# EAGLE design Spine14v1 (EAGLE 6.4)
AUTHOR_1: Jonathan Kurzer; AUTHOR_2: Jason Leung; AUTHOR_3: Matthew Sauve; AUTHOR_4: Ian Lin; AUTHOR_5: John Connolly; ORGANIZATION_INFO: Michigan Autonomous Aerial Vehicles; REV: 14v1

## Sheet 1 of 5
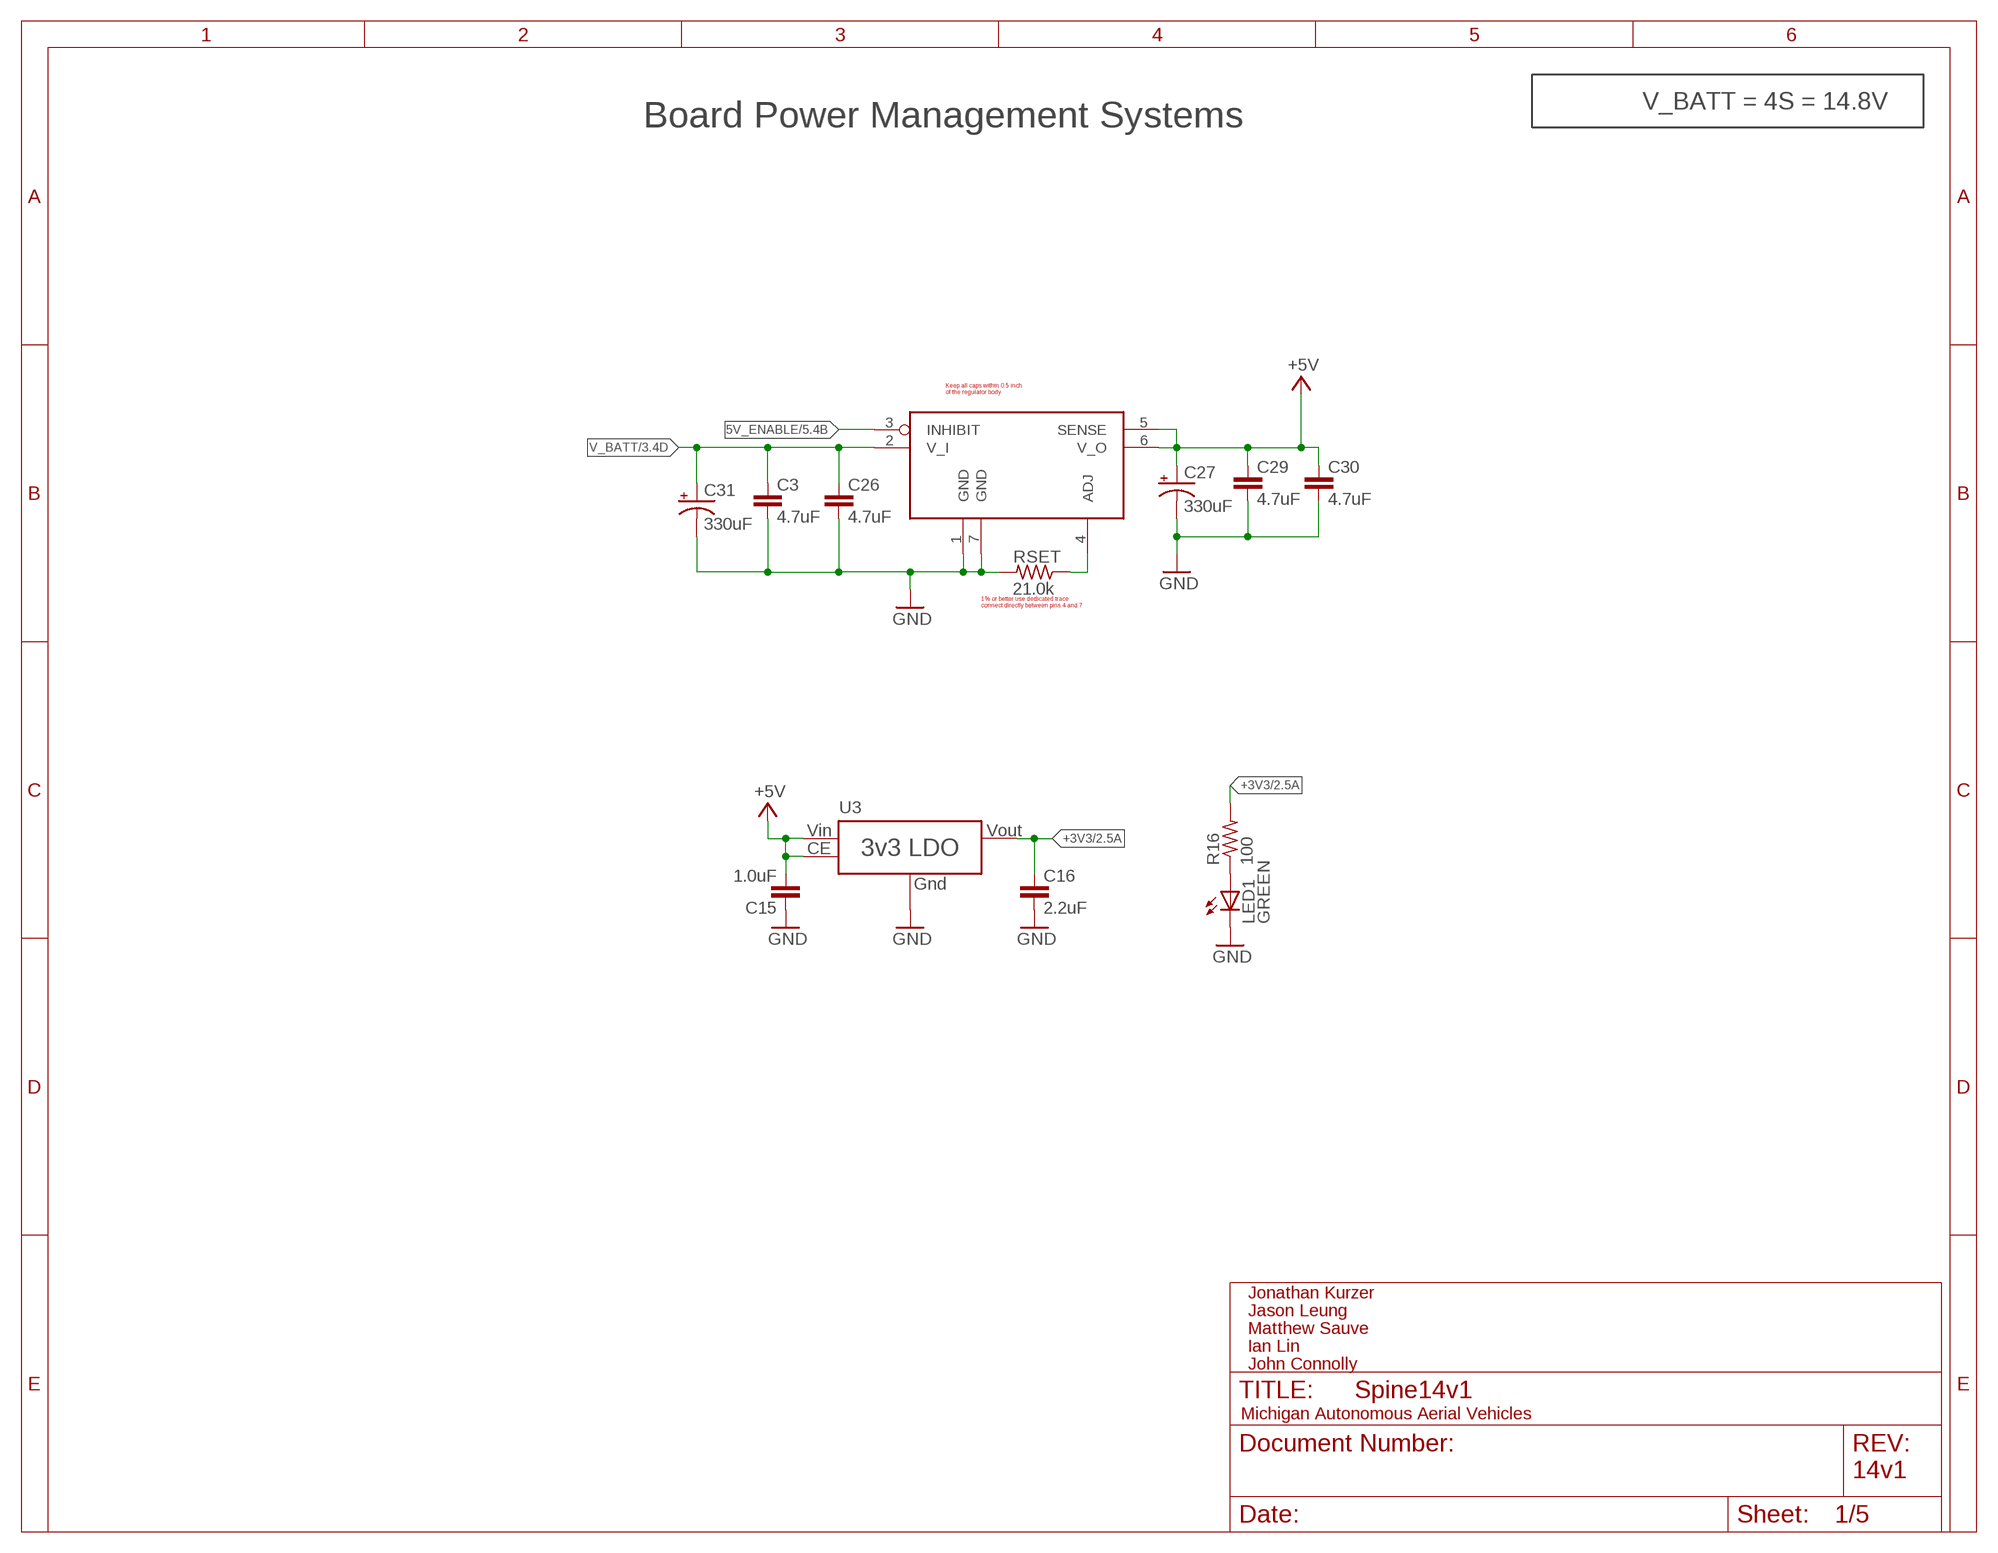
[diagram p0: schematic, sheet 1]

### Parts
C3  4.7uF  C-EUC1206  [C1206]
C15  1.0uF  C-EUC0805  [C0805]
C16  2.2uF  C-EUC0805  [C0805]
C26  4.7uF  C-EUC1206  [C1206]
C27  330uF  CPOL-USF  [PANASONIC_F]
C29  4.7uF  C-EUC1206  [C1206]
C30  4.7uF  C-EUC1206  [C1206]
C31  330uF  CPOL-USF  [PANASONIC_F]
LED1  GREEN  LEDCHIPLED_0603  [CHIPLED_0603]
R16  100  R-USR0603  [R0603]
RSET  21.0k  R-USR0603  [R0603]
U3  XC6210  [SOT-25]
U$5  POWER-MODULE-TI-6A_SOLDERLESS_TERMINAL  [POWER-MOD-TI-6A-SOLDERLESS-TERMINAL]

### Nets
5V_ENABLE: U$5.3(INHIBIT) ; also sheet 5
+3V3: C16.1 R16.2 U3.5(VOUT) ; also sheet 2,3,4,5
+5V: C15.2 C27.+ C29.1 C30.1 U3.1(VIN) U3.3(CE) U$5.5(SENSE) U$5.6(V_O) ; also sheet 2,3,5
GND: C3.2 C15.1 C16.2 C26.2 C27.- C29.2 C30.2 C31.- LED1.C RSET.2 U3.2(GND) U$5.1(GND) U$5.7(GND) ; also sheet 2,3,4,5
N$8: LED1.A R16.1
N$18: RSET.1 U$5.4(ADJ)
V_BATT: C3.1 C26.1 C31.+ U$5.2(V_I) ; also sheet 3,5

### Notes on the sheet
- V_BATT = 4S = 14.8V
- Board Power Management Systems
- Keep all caps within 0.5 inch
  of the regulator body
- 1% or better use dedicated trace
  connect directly between pins 4 and 7

## Sheet 2 of 5
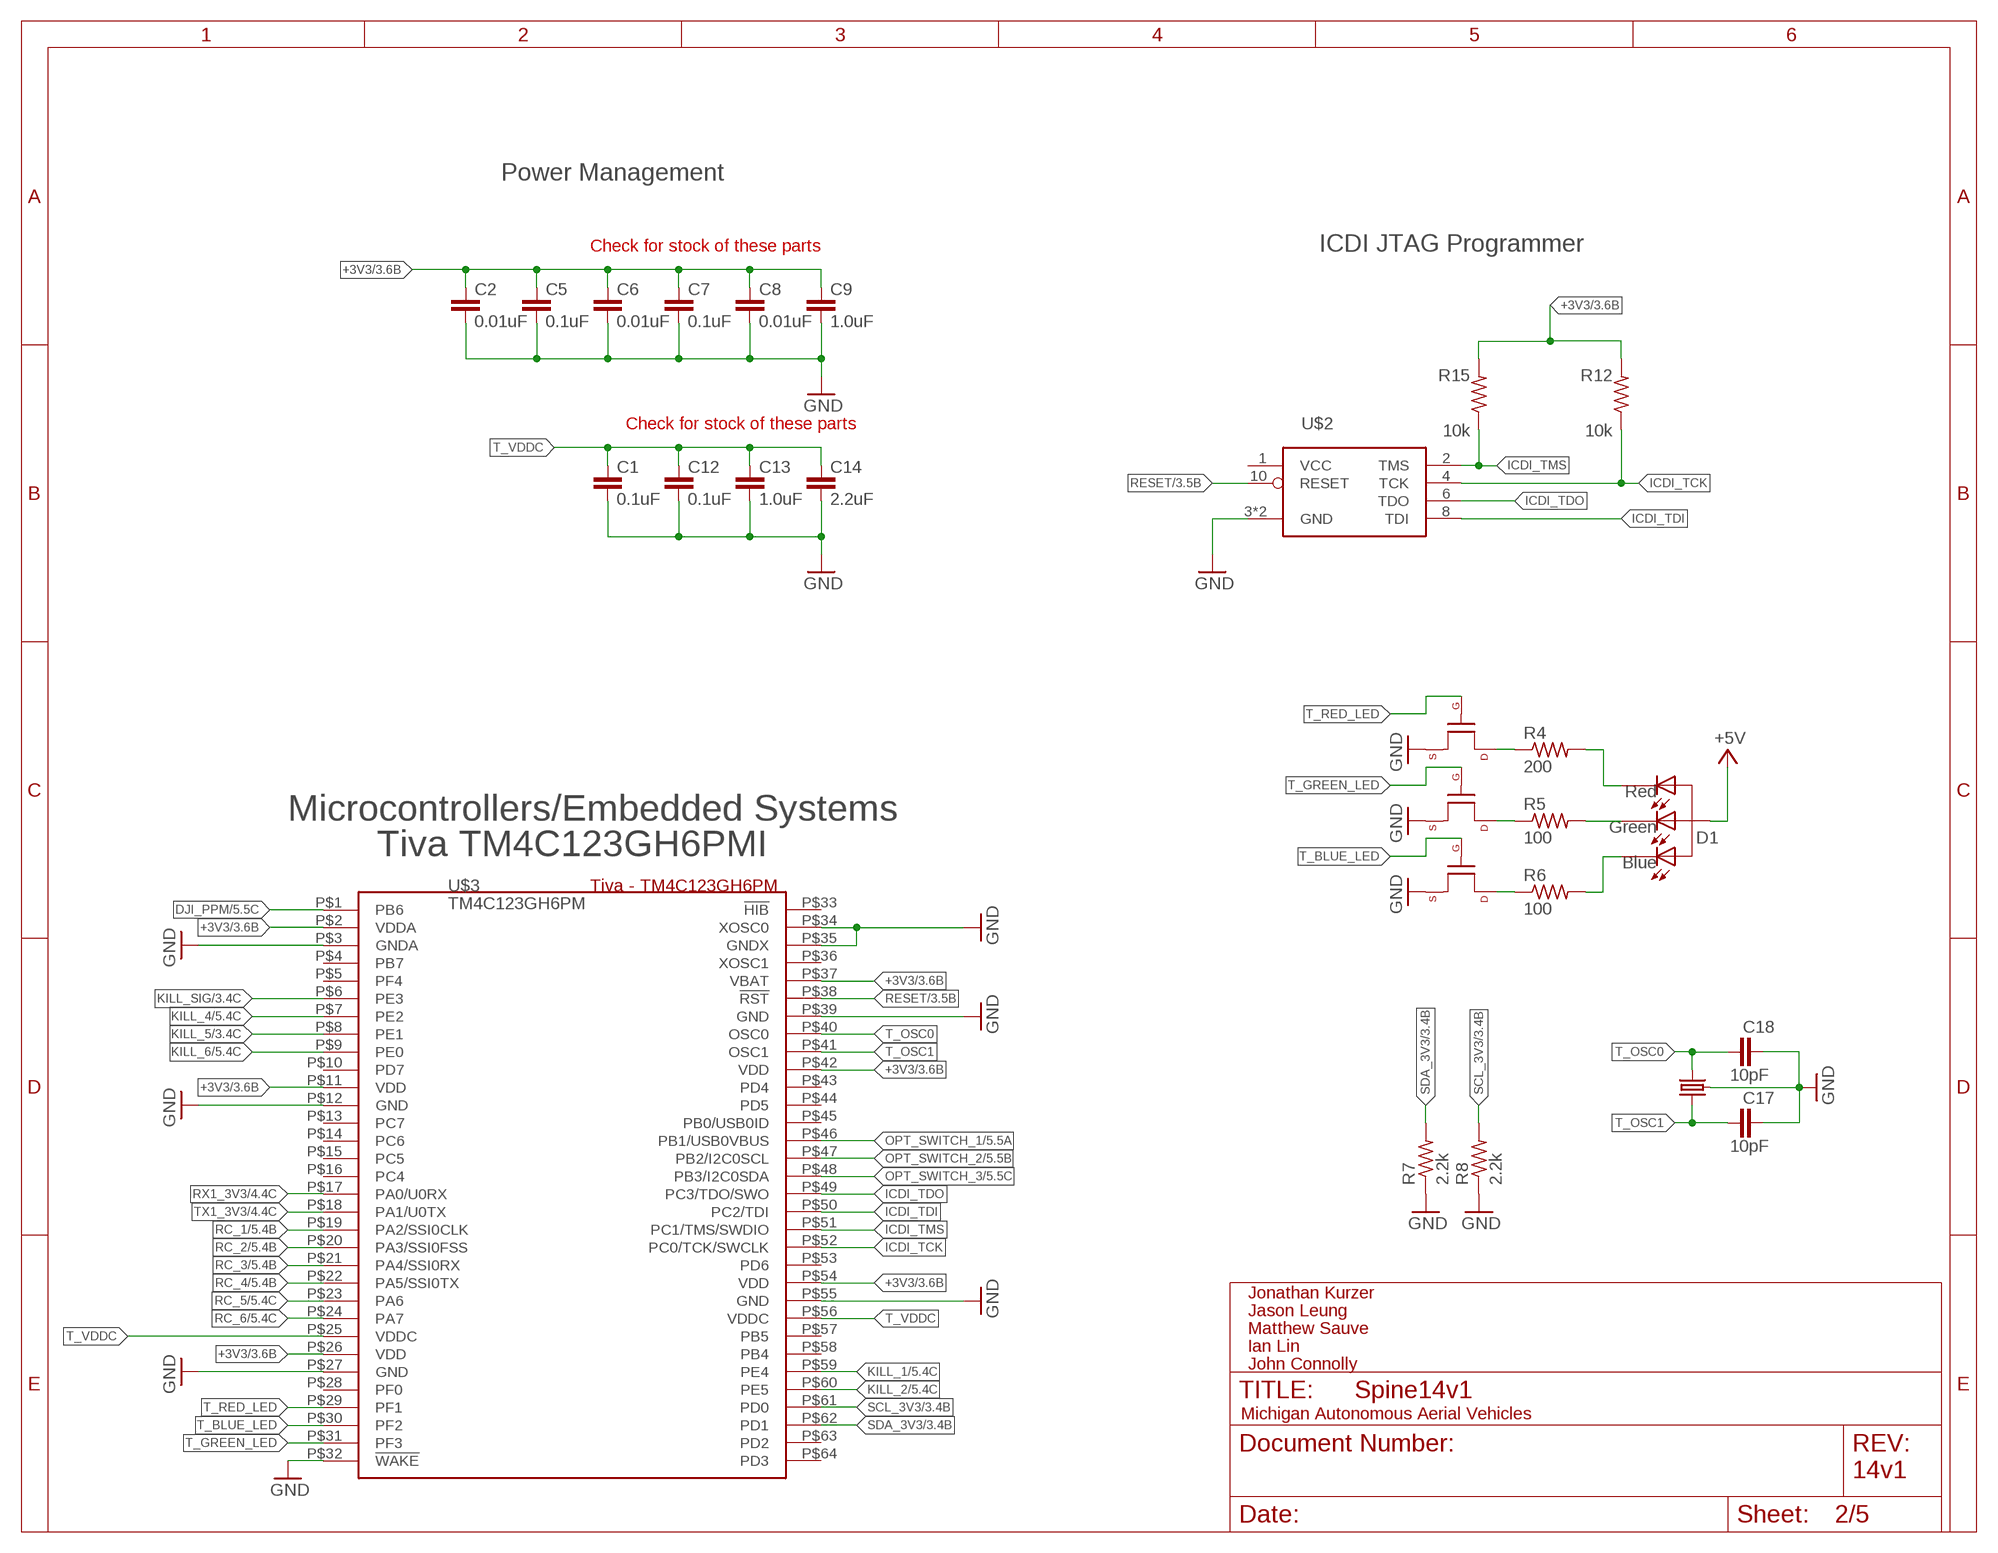
[diagram p1: schematic, sheet 2]

### Parts
C1  0.1uF  C-EUC0603  [C0603]
C2  0.01uF  C-EUC0603  [C0603]
C5  0.1uF  C-EUC0603  [C0603]
C6  0.01uF  C-EUC0603  [C0603]
C7  0.1uF  C-EUC0603  [C0603]
C8  0.01uF  C-EUC0603  [C0603]
C9  1.0uF  C-EUC0603  [C0603]
C12  0.1uF  C-EUC0603  [C0603]
C13  1.0uF  C-EUC0805  [C0805]
C14  2.2uF  C-EUC0805  [C0805]
C17  10pF  C-EUC0603  [C0603]
C18  10pF  C-EUC0603  [C0603]
D1  LED_RGB_CA  [LED_RGB_0606]
Q2  MOSFET-NCHANNELSMD  [SOT23-3]
Q3  MOSFET-NCHANNELSMD  [SOT23-3]
Q4  MOSFET-NCHANNELSMD  [SOT23-3]
R4  200  R-USR0603  [R0603]
R5  100  R-USR0603  [R0603]
R6  100  R-USR0603  [R0603]
R7  2.2k  R-USR0603  [R0603]
R8  2.2k  R-USR0603  [R0603]
R12  10k  R-USR0603  [R0603]
R15  10k  R-USR0603  [R0603]
U$1  CRYSTAL_403C11E16  [4-SMD-SWITCH]
U$2  JTAG-ARM_TC-10  [TC2050-IDC]
U$3  TM4C123GH6PM  [TM4C123GH6PM]

### Nets
+3V3: C2.1 C5.1 C6.1 C7.1 C8.1 C9.1 R12.2 R15.2 U$3.P$2(VDDA) U$3.P$11(VDD) U$3.P$26(VDD) U$3.P$37(VBAT) U$3.P$42(VDD) U$3.P$54(VDD) ; also sheet 1,3,4,5
+5V: D1.1(A) ; also sheet 1,3,5
DJI_PPM: U$3.P$1(PB6) ; also sheet 5
GND: C1.2 C2.2 C5.2 C6.2 C7.2 C8.2 C9.2 C12.2 C13.2 C14.2 C17.2 C18.2 Q2.2(S) Q3.2(S) Q4.2(S) R7.1 R8.1 U$1.2(GND) U$1.4(GND) U$2.3(GND) U$2.9(GND) U$3.P$3(GNDA) U$3.P$12(GND) U$3.P$27(GND) U$3.P$32(!WAKE) U$3.P$34(XOSC0) U$3.P$35(GNDX) U$3.P$39(GND) U$3.P$55(GND) ; also sheet 1,3,4,5
ICDI_TCK: R12.1 U$2.4(TCK) U$3.P$52(PC0/TCK/SWCLK)
ICDI_TDI: U$2.8(TDI) U$3.P$50(PC2/TDI)
ICDI_TDO: U$2.6(TDO) U$3.P$49(PC3/TDO/SWO)
ICDI_TMS: R15.1 U$2.2(TMS) U$3.P$51(PC1/TMS/SWDIO)
KILL_1: U$3.P$59(PE4) ; also sheet 5
KILL_2: U$3.P$60(PE5) ; also sheet 5
KILL_4: U$3.P$7(PE2) ; also sheet 5
KILL_5: U$3.P$8(PE1) ; also sheet 3,5
KILL_6: U$3.P$9(PE0) ; also sheet 5
KILL_SIG: U$3.P$6(PE3) ; also sheet 3,5
N$3: Q4.3(D) R4.1
N$4: Q3.3(D) R5.1
N$5: Q2.3(D) R6.1
N$6: D1.2(R) R4.2
N$7: D1.3(G) R5.2
N$19: D1.4(B) R6.2
OPT_SWITCH_1: U$3.P$46(PB1/USB0VBUS) ; also sheet 5
OPT_SWITCH_2: U$3.P$47(PB2/I2C0SCL) ; also sheet 5
OPT_SWITCH_3: U$3.P$48(PB3/I2C0SDA) ; also sheet 5
RC_1: U$3.P$19(PA2/SSI0CLK) ; also sheet 5
RC_2: U$3.P$20(PA3/SSI0FSS) ; also sheet 5
RC_3: U$3.P$21(PA4/SSI0RX) ; also sheet 5
RC_4: U$3.P$22(PA5/SSI0TX) ; also sheet 5
RC_5: U$3.P$23(PA6) ; also sheet 5
RC_6: U$3.P$24(PA7) ; also sheet 5
RESET: U$2.10(RESET) U$3.P$38(!RST) ; also sheet 3,5
RX1_3V3: U$3.P$17(PA0/U0RX) ; also sheet 4
SCL_3V3: R8.2 U$3.P$61(PD0) ; also sheet 3,5
SDA_3V3: R7.2 U$3.P$62(PD1) ; also sheet 3,5
T_BLUE_LED: Q2.1(G) U$3.P$30(PF2)
T_GREEN_LED: Q3.1(G) U$3.P$31(PF3)
T_OSC0: C18.1 U$1.3 U$3.P$40(OSC0)
T_OSC1: C17.1 U$1.1 U$3.P$41(OSC1)
T_RED_LED: Q4.1(G) U$3.P$29(PF1)
T_VDDC: C1.1 C12.1 C13.1 C14.1 U$3.P$25(VDDC) U$3.P$56(VDDC)
TX1_3V3: U$3.P$18(PA1/U0TX) ; also sheet 4
Unconnected: U$2.1(VCC) U$3.P$4(PB7) U$3.P$5(PF4) U$3.P$10(PD7) U$3.P$13(PC7) U$3.P$14(PC6) U$3.P$15(PC5) U$3.P$16(PC4) U$3.P$28(PF0) U$3.P$33(!HIB) U$3.P$36(XOSC1) U$3.P$43(PD4) U$3.P$44(PD5) U$3.P$45(PB0/USB0ID) U$3.P$53(PD6) U$3.P$57(PB5) U$3.P$58(PB4) U$3.P$63(PD2) U$3.P$64(PD3)

### Notes on the sheet
- Power Management
- Check for stock of these parts | ICDI JTAG Programmer
- Check for stock of these parts
- Microcontrollers/Embedded Systems
- Tiva TM4C123GH6PMI

## Sheet 3 of 5
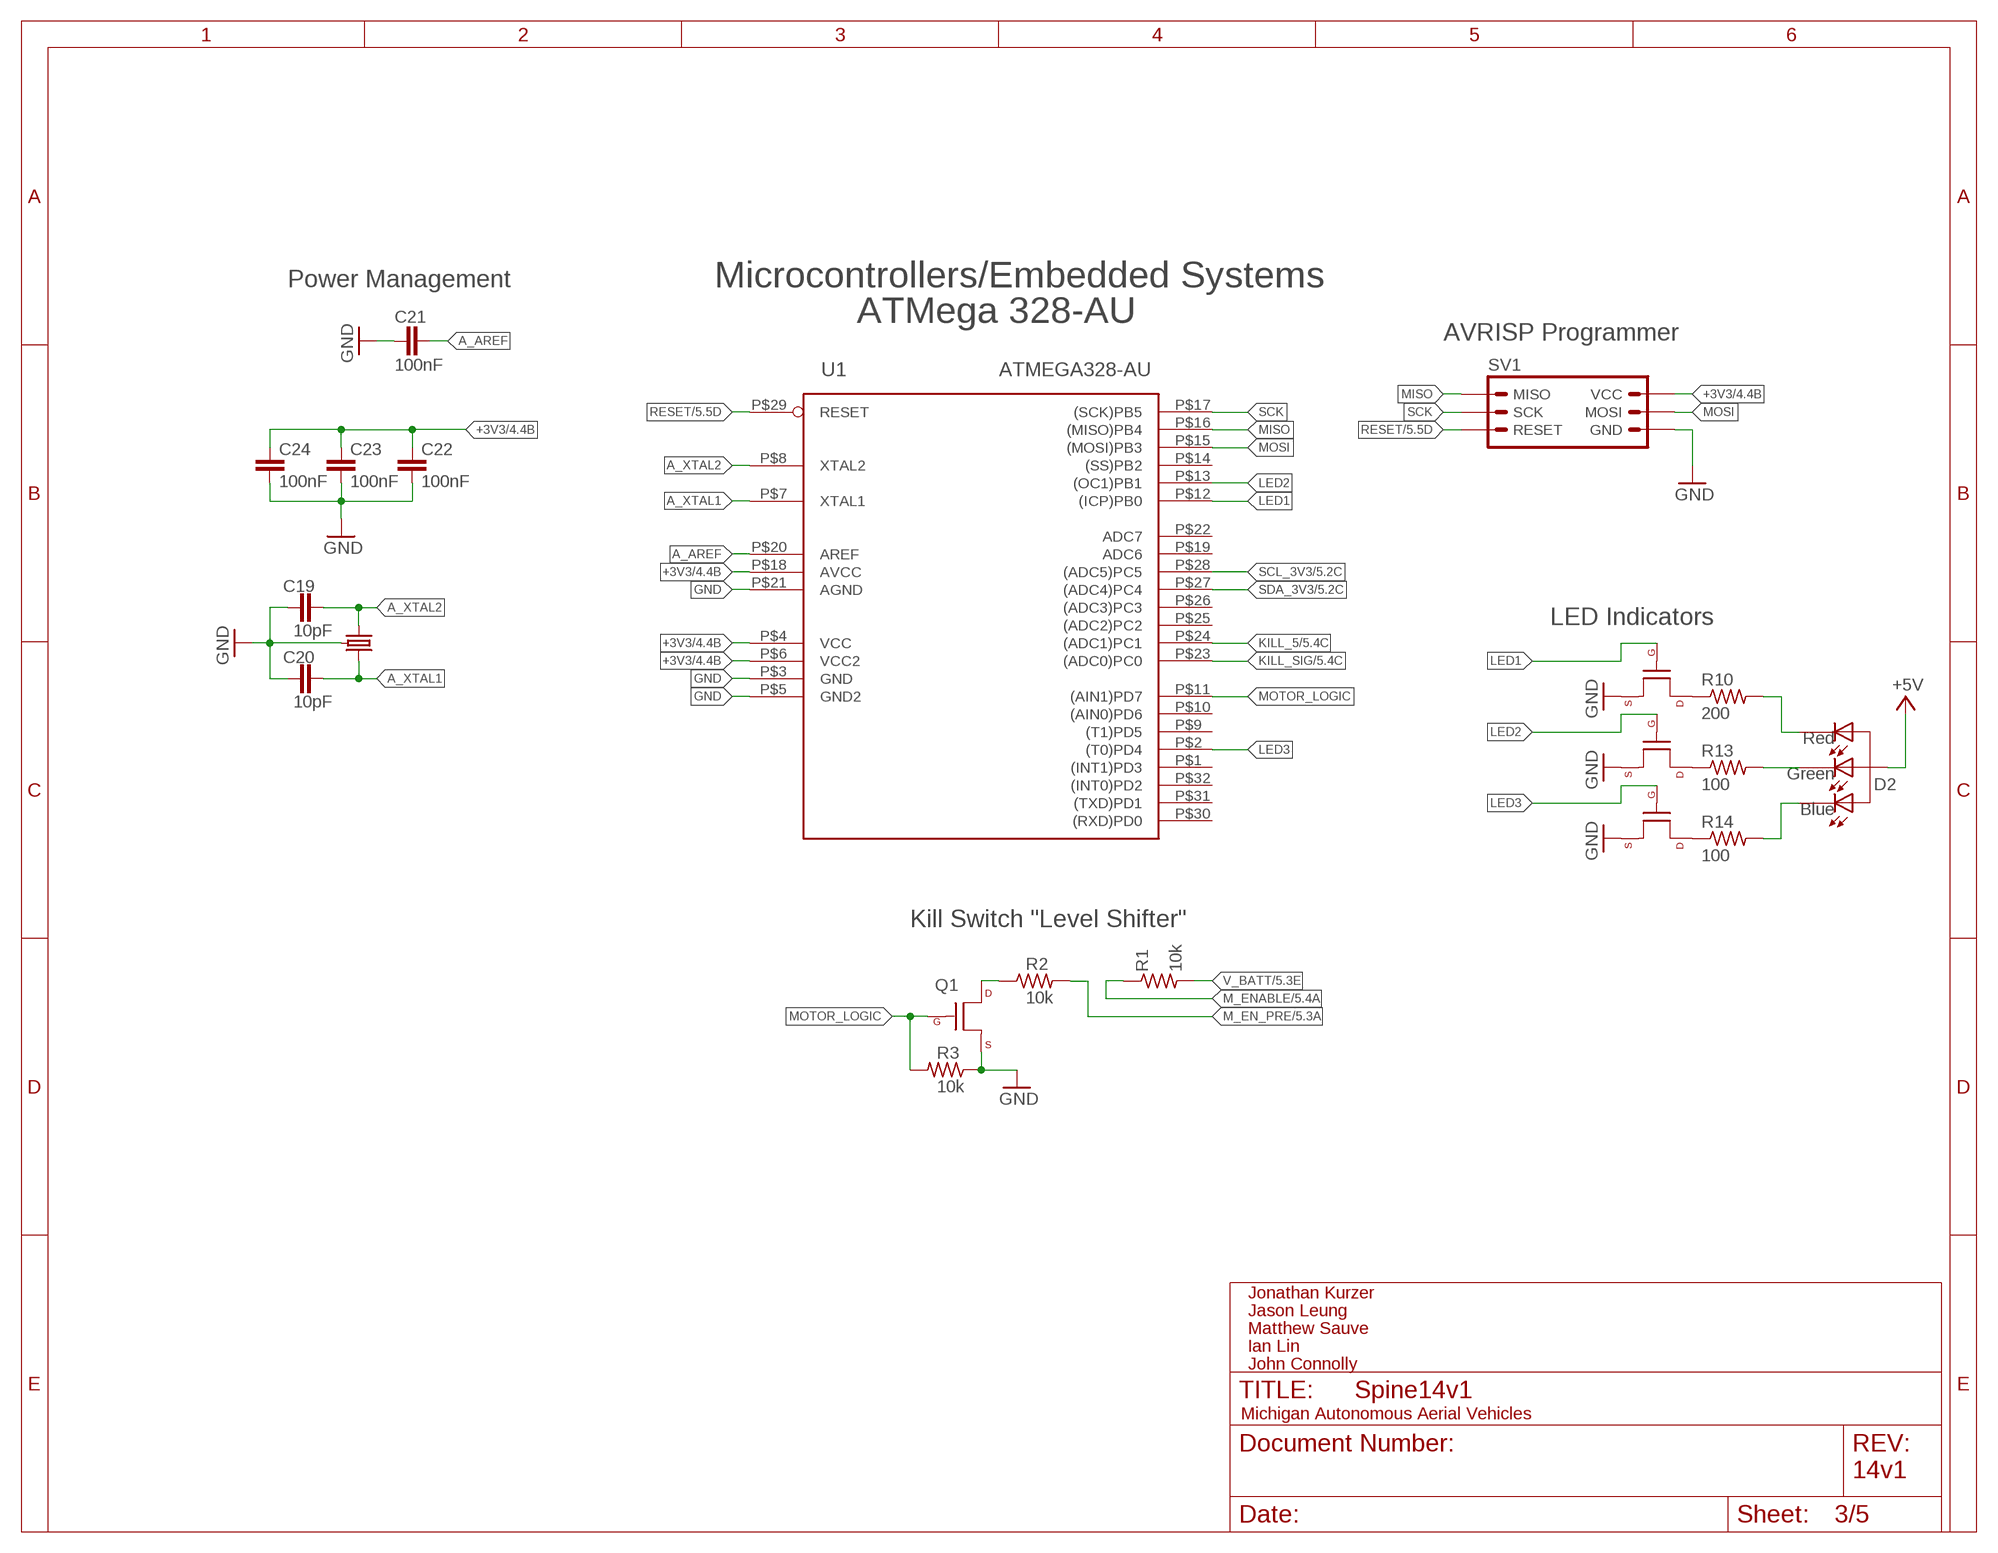
[diagram p2: schematic, sheet 3]

### Parts
C19  10pF  C-EUC0603  [C0603]
C20  10pF  C-EUC0603  [C0603]
C21  100nF  C-EUC0603  [C0603]
C22  100nF  C-EUC0603  [C0603]
C23  100nF  C-EUC0603  [C0603]
C24  100nF  C-EUC0603  [C0603]
D2  LED_RGB_CA  [LED_RGB_0606]
Q1  MOSFET-NCHANNELSMD  [SOT23-3]
Q6  MOSFET-NCHANNELSMD  [SOT23-3]
Q7  MOSFET-NCHANNELSMD  [SOT23-3]
Q8  MOSFET-NCHANNELSMD  [SOT23-3]
R1  10k  R-USR0603  [R0603]
R2  10k  R-USR0603  [R0603]
R3  10k  R-USR0603  [R0603]
R10  200  R-USR0603  [R0603]
R13  100  R-USR0603  [R0603]
R14  100  R-USR0603  [R0603]
SV1  AVRISP-6_3X2_PLUG_OF_NAILS  [TC2030-IDC]
U1  ATMEGA328-AU  [32-TQFP]
U$6  CRYSTAL_403C11E16  [4-SMD-SWITCH]

### Nets
+3V3: C22.1 C23.1 C24.1 SV1.6(VCC) U1.P$4(VCC) U1.P$6(VCC2) U1.P$18(AVCC) ; also sheet 1,2,4,5
+5V: D2.1(A) ; also sheet 1,2,5
A_AREF: C21.1 U1.P$20(AREF)
A_XTAL1: C20.2 U1.P$7(XTAL1) U$6.3
A_XTAL2: C19.2 U1.P$8(XTAL2) U$6.1
GND: C19.1 C20.1 C21.2 C22.2 C23.2 C24.2 Q1.2(S) Q6.2(S) Q7.2(S) Q8.2(S) R3.1 SV1.4(GND) U1.P$3(GND) U1.P$5(GND2) U1.P$21(AGND) U$6.2(GND) U$6.4(GND) ; also sheet 1,2,4,5
KILL_5: U1.P$24((ADC1)PC1) ; also sheet 2,5
KILL_SIG: U1.P$23((ADC0)PC0) ; also sheet 2,5
LED1: Q8.1(G) U1.P$12((ICP)PB0)
LED2: Q7.1(G) U1.P$13((OC1)PB1)
LED3: Q6.1(G) U1.P$2((T0)PD4)
M_EN_PRE: R2.2 ; also sheet 5
M_ENABLE: R1.1 ; also sheet 5
MISO: SV1.1(MISO) U1.P$16((MISO)PB4)
MOSI: SV1.5(MOSI) U1.P$15((MOSI)PB3)
MOTOR_LOGIC: Q1.1(G) R3.2 U1.P$11((AIN1)PD7)
N$1: Q1.3(D) R2.1
N$12: Q8.3(D) R10.1
N$20: Q7.3(D) R13.1
N$22: Q6.3(D) R14.1
N$23: D2.2(R) R10.2
N$24: D2.3(G) R13.2
N$25: D2.4(B) R14.2
RESET: SV1.3(RESET) U1.P$29(RESET) ; also sheet 2,5
SCK: SV1.2(SCK) U1.P$17((SCK)PB5)
SCL_3V3: U1.P$28((ADC5)PC5) ; also sheet 2,5
SDA_3V3: U1.P$27((ADC4)PC4) ; also sheet 2,5
V_BATT: R1.2 ; also sheet 1,5
Unconnected: U1.P$1((INT1)PD3) U1.P$9((T1)PD5) U1.P$10((AIN0)PD6) U1.P$14((SS)PB2) U1.P$19(ADC6) U1.P$22(ADC7) U1.P$25((ADC2)PC2) U1.P$26((ADC3)PC3) U1.P$30((RXD)PD0) U1.P$31((TXD)PD1) U1.P$32((INT0)PD2)

### Notes on the sheet
- Power Management | Microcontrollers/Embedded Systems
- ATMega 328-AU
- AVRISP Programmer
- LED Indicators
- Kill Switch "Level Shifter"

## Sheet 4 of 5
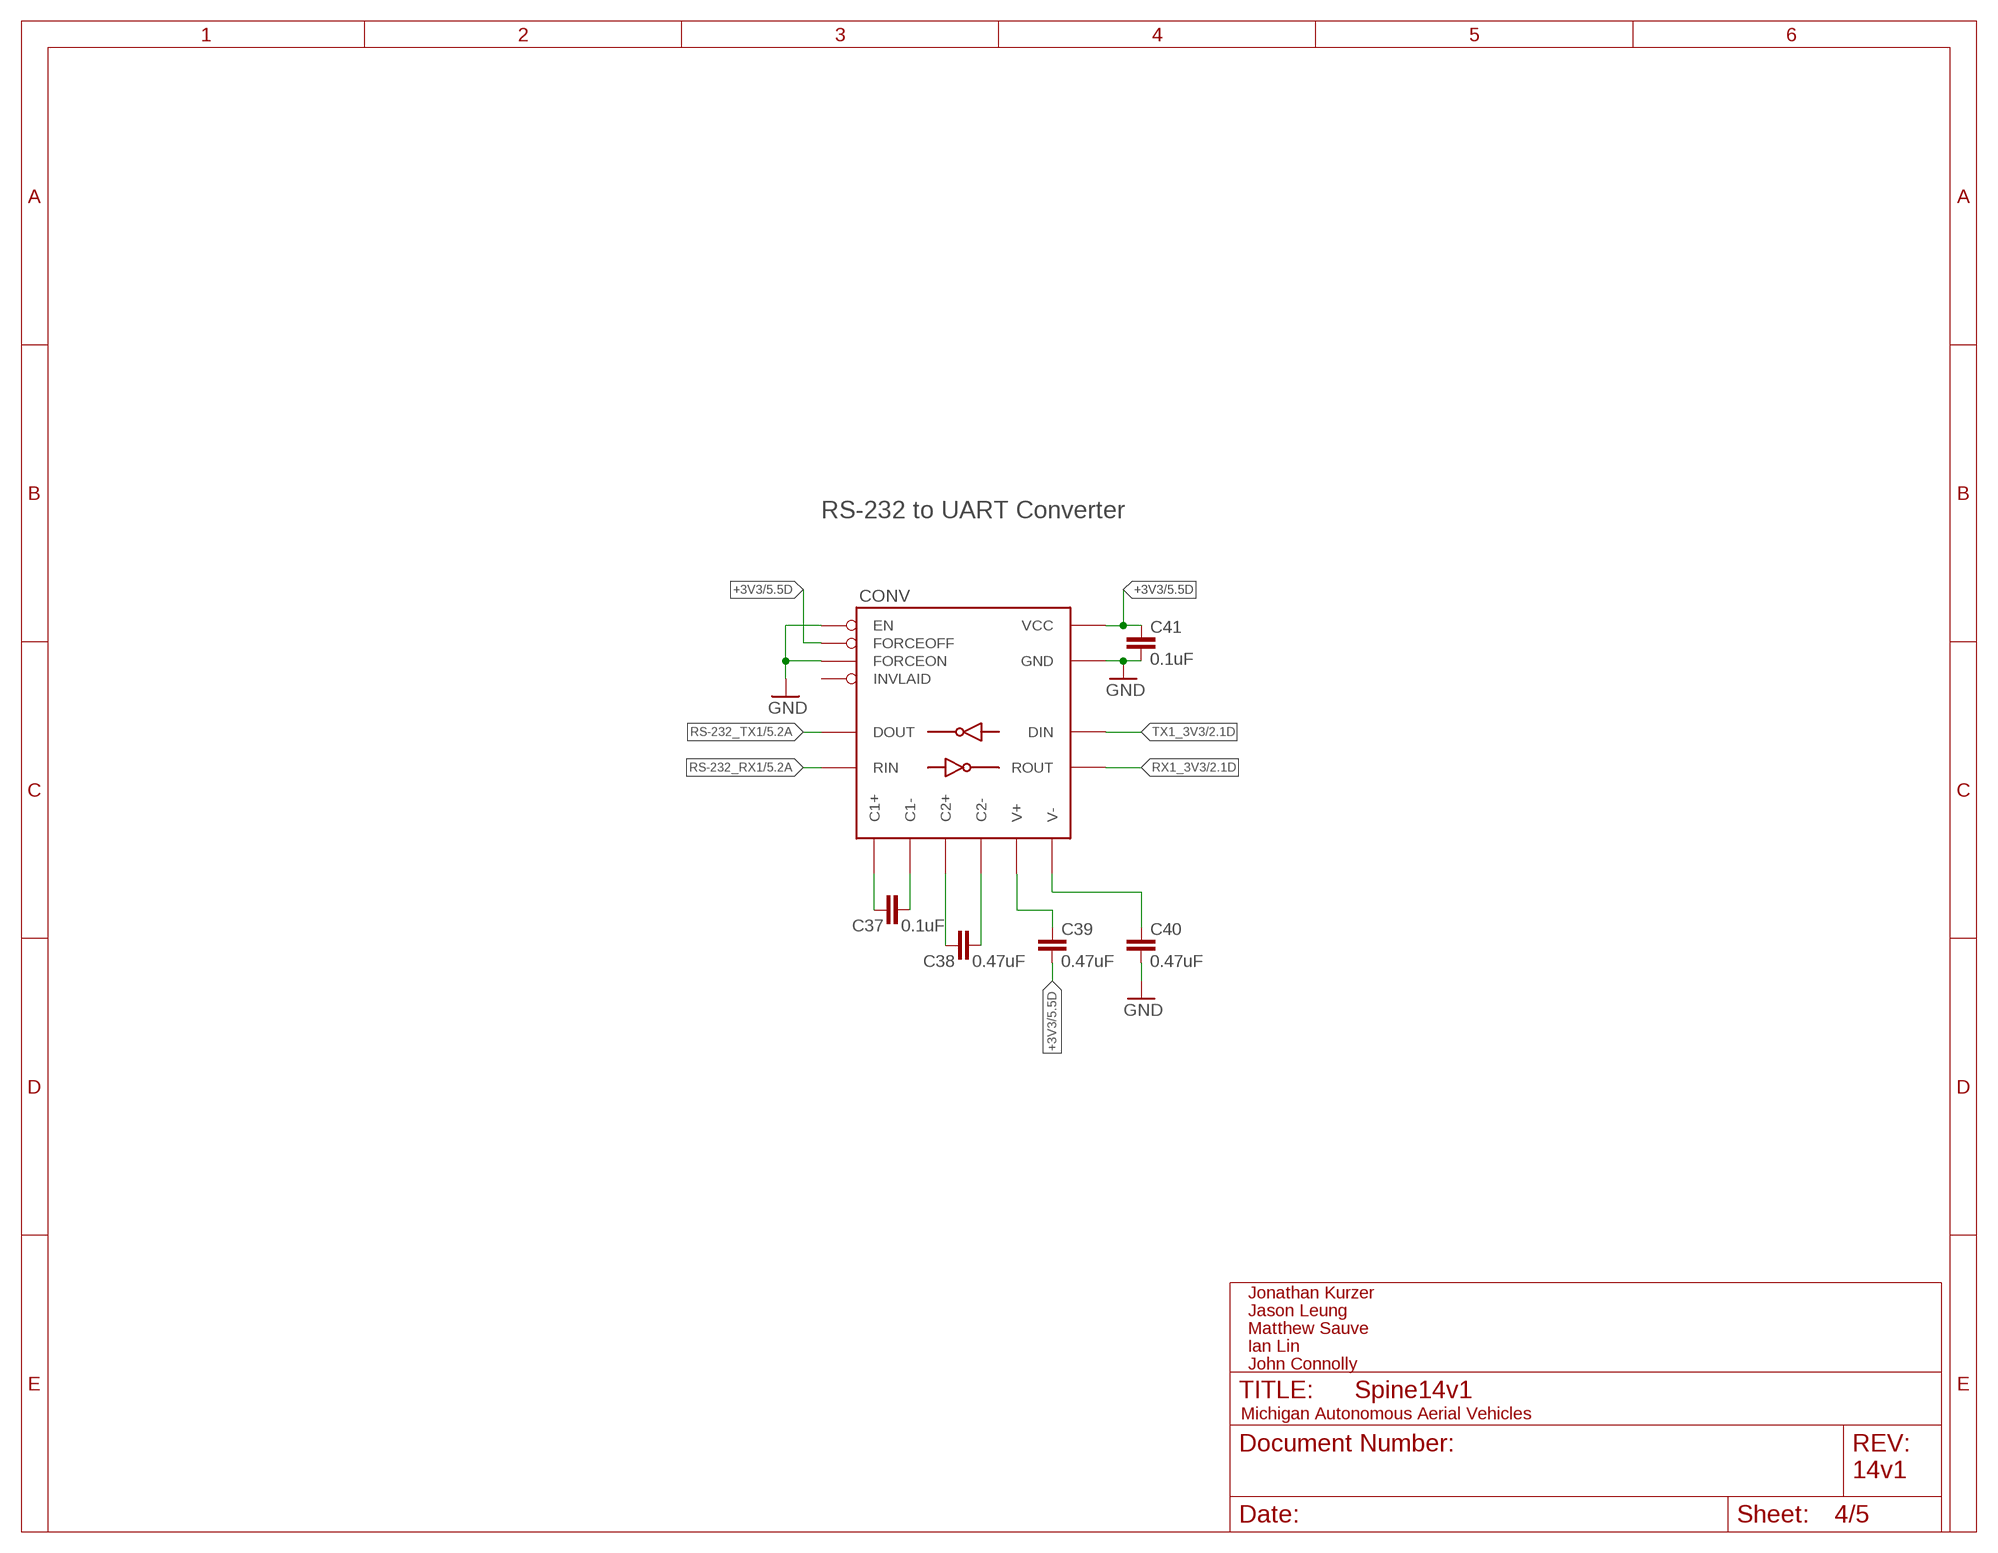
[diagram p3: schematic, sheet 4]

### Parts
C37  0.1uF  C-EUC0603  [C0603]
C38  0.47uF  C-EUC0805  [C0805]
C39  0.47uF  C-EUC0805  [C0805]
C40  0.47uF  C-EUC0805  [C0805]
C41  0.1uF  C-EUC0603  [C0603]
CONV  MAX3221-RS232  [16-TSSOP]

### Nets
+3V3: C39.2 C41.1 CONV.P$15(VCC) CONV.P$16(FORCEOFF) ; also sheet 1,2,3,5
GND: C40.2 C41.2 CONV.P$1(EN) CONV.P$12(FORCEON) CONV.P$14(GND) ; also sheet 1,2,3,5
N$11: C37.1 CONV.P$2(C1+)
N$13: C39.1 CONV.P$3(V+)
N$14: C40.1 CONV.P$7(V-)
N$32: C37.2 CONV.P$4(C1-)
N$35: C38.1 CONV.P$5(C2+)
N$36: C38.2 CONV.P$6(C2-)
RS-232_RX1: CONV.P$8(RIN) ; also sheet 5
RS-232_TX1: CONV.P$13(DOUT) ; also sheet 5
RX1_3V3: CONV.P$9(ROUT) ; also sheet 2
TX1_3V3: CONV.P$11(DIN) ; also sheet 2
Unconnected: CONV.P$10(INVLAID)

### Notes on the sheet
- RS-232 to UART Converter

## Sheet 5 of 5
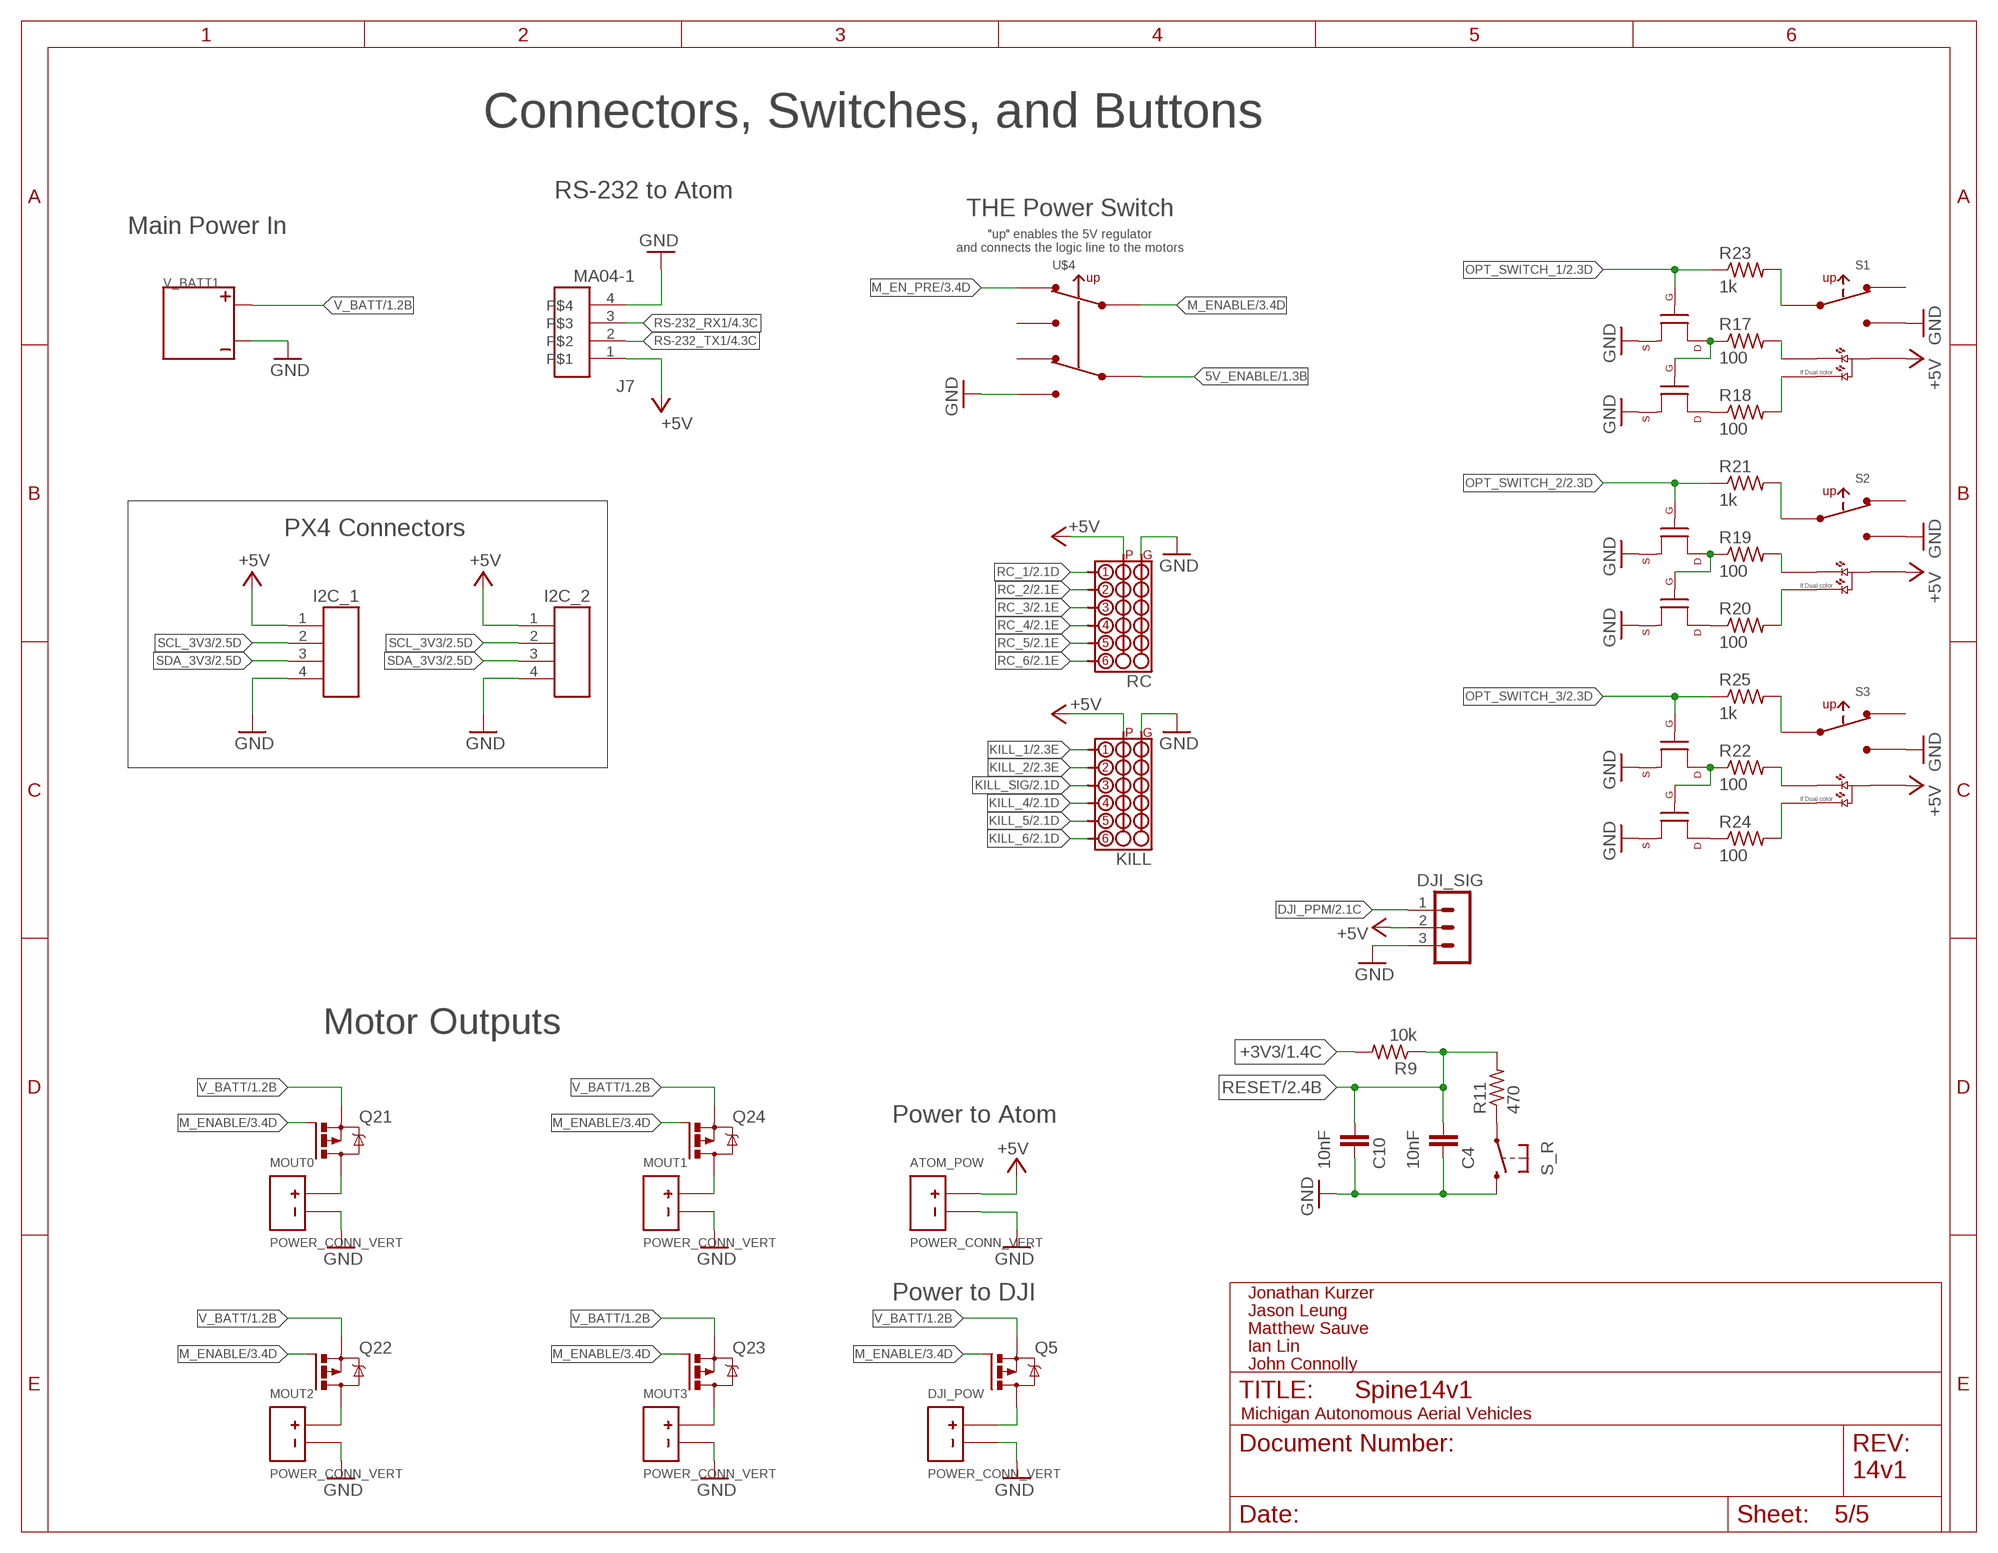
[diagram p4: schematic, sheet 5]

### Parts
ATOM_POW  POWER_CONN_VERT  [POWER_CONN]
C4  10nF  C-EUC0603  [C0603]
C10  10nF  C-EUC0603  [C0603]
DJI_POW  POWER_CONN_VERT  [POWER_CONN]
DJI_SIG  MA03-1  [MA03-1]
I2C_1  CONN_HEADER_4POS_RIGHT_ANGLE_I2C  [CONN_HEADER_4POS_1.25MM_SMD]
I2C_2  CONN_HEADER_4POS_RIGHT_ANGLE_I2C  [CONN_HEADER_4POS_1.25MM_SMD]
J7  MA04-1  [MA-04-SMD]
KILL  RC_RECIEVER_RECEP  [RC_RECIEVER_RECEP]
MOUT0  POWER_CONN_VERT  [POWER_CONN]
MOUT1  POWER_CONN_VERT  [POWER_CONN]
MOUT2  POWER_CONN_VERT  [POWER_CONN]
MOUT3  POWER_CONN_VERT  [POWER_CONN]
Q5  P-MOSFET-SO8POWER-PAK  [SO-8_POWER-PAK]
Q9  MOSFET-NCHANNELSMD  [SOT23-3]
Q10  MOSFET-NCHANNELSMD  [SOT23-3]
Q11  MOSFET-NCHANNELSMD  [SOT23-3]
Q12  MOSFET-NCHANNELSMD  [SOT23-3]
Q13  MOSFET-NCHANNELSMD  [SOT23-3]
Q14  MOSFET-NCHANNELSMD  [SOT23-3]
Q21  P-MOSFET-SO8POWER-PAK  [SO-8_POWER-PAK]
Q22  P-MOSFET-SO8POWER-PAK  [SO-8_POWER-PAK]
Q23  P-MOSFET-SO8POWER-PAK  [SO-8_POWER-PAK]
Q24  P-MOSFET-SO8POWER-PAK  [SO-8_POWER-PAK]
R9  10k  R-USR0603  [R0603]
R11  470  R-USR0603  [R0603]
R17  100  R-USR0603  [R0603]
R18  100  R-USR0603  [R0603]
R19  100  R-USR0603  [R0603]
R20  100  R-USR0603  [R0603]
R21  1k  R-USR0603  [R0603]
R22  100  R-USR0603  [R0603]
R23  1k  R-USR0603  [R0603]
R24  100  R-USR0603  [R0603]
R25  1k  R-USR0603  [R0603]
RC  RC_RECIEVER_RECEP  [RC_RECIEVER_RECEP]
S1  SWITCH_SPDT_ILUMINATED_2COLOR_VERT_ILLUMINATED  [NKK_VERT_SWITCH_6PIN]
S2  SWITCH_SPDT_ILUMINATED_2COLOR_VERT_ILLUMINATED  [NKK_VERT_SWITCH_6PIN]
S3  SWITCH_SPDT_ILUMINATED_2COLOR_VERT_ILLUMINATED  [NKK_VERT_SWITCH_6PIN]
S_R  TACT_BUTTONSMD  [TACT-MOM-SMD]
U$4  JON_LIB_SWITCH_DPDT  [JON_LIB_SWITCH_VERT_DPDT]
V_BATT1  BATT-CONN-50A_MINI-FIT-SR_THRU-HOLE  [BATT-CONN-50A]

### Nets
5V_ENABLE: U$4.P$5 ; also sheet 1
+3V3: R9.2 ; also sheet 1,2,3,4
+5V: ATOM_POW.P1(P) DJI_SIG.2 I2C_1.1 I2C_2.1 J7.1 KILL.VCC KILL.VCC2(VCC) RC.VCC RC.VCC2(VCC) S1.P$5 S2.P$5 S3.P$5 ; also sheet 1,2,3
DJI_PPM: DJI_SIG.1 ; also sheet 2
GND: ATOM_POW.P2(N) C4.2 C10.2 DJI_POW.P2(N) DJI_SIG.3 I2C_1.4 I2C_2.4 J7.4 KILL.GND KILL.GND2(GND) MOUT0.P2(N) MOUT1.P2(N) MOUT2.P2(N) MOUT3.P2(N) Q9.2(S) Q10.2(S) Q11.2(S) Q12.2(S) Q13.2(S) Q14.2(S) RC.GND RC.GND2(GND) S1.P$1 S2.P$1 S3.P$1 S_R.S S_R.S1(S) U$4.P$6 V_BATT1.GND-1(GND) V_BATT1.GND-2(GND) ; also sheet 1,2,3,4
KILL_1: KILL.P$1 ; also sheet 2
KILL_2: KILL.P$2 ; also sheet 2
KILL_4: KILL.P$4 ; also sheet 2
KILL_5: KILL.P$5 ; also sheet 2,3
KILL_6: KILL.P$6 ; also sheet 2
KILL_SIG: KILL.P$3 ; also sheet 2,3
M_EN_PRE: U$4.P$1 ; also sheet 3
M_ENABLE: Q5.G Q21.G Q22.G Q23.G Q24.G U$4.P$2 ; also sheet 3
N$2: MOUT0.P1(P) Q21.D1 Q21.D2(D1) Q21.D3(D1) Q21.D4(D1) Q21.D5(D1)
N$9: Q9.1(G) Q10.3(D) R17.1
N$10: R11.1 S_R.P S_R.P1(P)
N$15: MOUT1.P1(P) Q24.D1 Q24.D2(D1) Q24.D3(D1) Q24.D4(D1) Q24.D5(D1)
N$16: MOUT2.P1(P) Q22.D1 Q22.D2(D1) Q22.D3(D1) Q22.D4(D1) Q22.D5(D1)
N$17: MOUT3.P1(P) Q23.D1 Q23.D2(D1) Q23.D3(D1) Q23.D4(D1) Q23.D5(D1)
N$21: DJI_POW.P1(P) Q5.D1 Q5.D2(D1) Q5.D3(D1) Q5.D4(D1) Q5.D5(D1)
N$26: Q9.3(D) R18.1
N$27: Q11.1(G) Q12.3(D) R19.1
N$28: Q11.3(D) R20.1
N$29: R19.2 S2.P$6
N$30: R20.2 S2.P$4
N$31: R23.2 S1.P$2
N$33: R21.2 S2.P$2
N$34: R17.2 S1.P$6
N$37: R18.2 S1.P$4
N$39: Q13.1(G) Q14.3(D) R22.1
N$40: Q13.3(D) R24.1
N$41: R22.2 S3.P$6
N$42: R24.2 S3.P$4
N$43: R25.2 S3.P$2
OPT_SWITCH_1: Q10.1(G) R23.1 ; also sheet 2
OPT_SWITCH_2: Q12.1(G) R21.1 ; also sheet 2
OPT_SWITCH_3: Q14.1(G) R25.1 ; also sheet 2
RC_1: RC.P$1 ; also sheet 2
RC_2: RC.P$2 ; also sheet 2
RC_3: RC.P$3 ; also sheet 2
RC_4: RC.P$4 ; also sheet 2
RC_5: RC.P$5 ; also sheet 2
RC_6: RC.P$6 ; also sheet 2
RESET: C4.1 C10.1 R9.1 R11.2 ; also sheet 2,3
RS-232_RX1: J7.3 ; also sheet 4
RS-232_TX1: J7.2 ; also sheet 4
SCL_3V3: I2C_1.2 I2C_2.2 ; also sheet 2,3
SDA_3V3: I2C_1.3 I2C_2.3 ; also sheet 2,3
V_BATT: Q5.S1 Q5.S2(S1) Q5.S3(S1) Q21.S1 Q21.S2(S1) Q21.S3(S1) Q22.S1 Q22.S2(S1) Q22.S3(S1) Q23.S1 Q23.S2(S1) Q23.S3(S1) Q24.S1 Q24.S2(S1) Q24.S3(S1) V_BATT1.VCC-1(VCC) V_BATT1.VCC-2(VCC) ; also sheet 1,3
Unconnected: S1.P$3 S2.P$3 S3.P$3 U$4.P$3 U$4.P$4

### Notes on the sheet
- Connectors, Switches, and Buttons
- RS-232 to Atom
- THE Power Switch
- Main Power In
- "up" enables the 5V regulator
  and connects the logic line to the motors
- PX4 Connectors
- Motor Outputs
- Power to Atom
- Power to DJI

## Library data of the parts
ATOM_POW DJI_POW MOUT0 MOUT1-MOUT3 = MAAV:POWER_CONN; DIGIKEY: A30614-ND
C1 C2 C4-C10 C12-C16 = Jon_LIB:C-EU: CAPACITOR, European symbol
C3 C26 C29 C30 = Jon_LIB:C-EU: CAPACITOR, European symbol; DIGIKEY#: 587-2994-1-ND
C17-C20 = Jon_LIB:C-EU: CAPACITOR, European symbol; DIGIKEY#: 399-1049-1-ND
C21-C24 = Jon_LIB:C-EU: CAPACITOR, European symbol; DIGIKEY#: 1276-1000-1-ND
C27 C31 = rcl:CPOL-US: POLARIZED CAPACITOR, American symbol; DIGIKEY: PCE3779CT-ND
C37 C41 = Jon_LIB:C-EU: CAPACITOR, European symbol; DIGIKEY#: 490-1524-1-ND
C38-C40 = Jon_LIB:C-EU: CAPACITOR, European symbol; DIGIKEY#: 1276-2966-1-ND
CONV = Jon_LIB:MAX3221-RS232; DIGIKEY#: 296-19825-1-ND
D1 D2 = Jon_LIB:LED_RGB_CA; DIGIKEY#: 754-1500-1-ND
DJI_SIG = Jon_LIB:MA03-1: PIN HEADER; OC_FARNELL: unknown; OC_NEWARK: unknown
I2C_1 I2C_2 = MAAV:CONN_HEADER_4POS; DIGIKEY#: H3369-ND; MATE: D#H2181-ND
J7 = Jon_LIB:MA04-1; DIGIKEY#: 455-1751-1-ND
KILL RC = Jon_LIB:RC_RECIEVER_RECEP
LED1 = Jon_LIB:LED: LED OSRAM: - CHIPLED LG R971, LG N971, LY N971, LG Q971, LY Q971, LO R971, LY R971 LH N974, LH R974 LS Q976, LO Q976, LY Q976 LO Q996 - Hyper CHIPLED LW Q18S LB Q993, LB Q99A, LB R99A - SideLED LS A670, LO A670, LY A670, LG A670, LP A670 LB A673, LV A673, LT A673, LW A673 LH A674 LY A675 LS A676, LA A676, LO A676, LY A676, LW A676 LS A679, LY A679, LG A679 - Hyper Micro SIDELED® LS Y876, LA Y876, LO Y876, LY Y876 LT Y87S - SmartLED LW L88C, LW L88S LB L89C, LB L89S, LG L890 LS L89K, LO L89K, LY L89K LS L896, LA L896, LO L896, LY L896 - TOPLED LS T670, LO T670, LY T670, LG T670, LP T670 LSG T670, LSP T670, LSY T670, LOP T670, LYG T670 LG T671, LOG T671, LSG T671 LB T673, LV T673, LT T673, LW T673 LH T674 LS T676, LA T676, LO T676, LY T676, LB T676, LH T676, LSB T676, LW T676 LB T67C, LV T67C, LT T67C, LS T67K, LO T67K, LY T67K, LW E67C LS E67B, LA E67B, LO E67B, LY E67B, LB E67C, LV E67C, LT E67C LW T67C LS T679, LY T679, LG T679 LS T770, LO T770, LY T770, LG T770, LP T770 LB T773, LV T773, LT T773, LW T773 LH T774 LS E675, LA E675, LY E675, LS T675 LS T776, LA T776, LO T776, LY T776, LB T776 LHGB T686 LT T68C, LB T68C - Hyper Mini TOPLED® LB M676 - Mini TOPLED Santana® LG M470 LS M47K, LO M47K, LY M47K Source: http://www.osram.convergy.de LUXEON: - LUMILED® LXK2-PW12-R00, LXK2-PW12-S00, LXK2-PW14-U00, LXK2-PW14-V00 LXK2-PM12-R00, LXK2-PM12-S00, LXK2-PM14-U00 LXK2-PE12-Q00, LXK2-PE12-R00, LXK2-PE12-S00, LXK2-PE14-T00, LXK2-PE14-U00 LXK2-PB12-K00, LXK2-PB12-L00, LXK2-PB12-M00, LXK2-PB14-N00, LXK2-PB14-P00, LXK2-PB14-Q00 LXK2-PR12-L00, LXK2-PR12-M00, LXK2-PR14-Q00, LXK2-PR14-R00 LXK2-PD12-Q00, LXK2-PD12-R00, LXK2-PD12-S00 LXK2-PH12-R00, LXK2-PH12-S00 LXK2-PL12-P00, LXK2-PL12-Q00, LXK2-PL12-R00 Source: www.luxeon.com KINGBRIGHT: KA-3528ASYC Source: www.kingbright.com
Q1 = Jon_LIB:MOSFET-NCHANNEL; DIGIKEY: BSS138KCT-ND
Q2-Q4 Q6-Q14 = Jon_LIB:MOSFET-NCHANNEL
Q5 Q21-Q24 = Jon_LIB:P-MOSFET-SO8: P-Channel MOSFET Example: FDS4435A; P-Channel Logic Level PowerTrench® MOSFET FDS4465; P-Channel 1.8V Specified PowerTrench® MOSFET Source: www.fairchildsemi.com; DIGIKEY#: SI7135DP-T1-GE3CT-ND
R1-R25 RSET = Jon_LIB:R-US: RESISTOR, American symbol
S1-S3 = Jon_LIB:SWITCH_SPDT_ILUMINATED_2COLOR; DIGIKEY#: 360-1772-ND
S_R = Jon_LIB:TACT_BUTTON: OMRON SWITCH; DIGIKEY: P11084SCT-ND
SV1 = MAAV:AVRISP-6: PIN HEADER
U1 = MAAV:ATMEGA328-AU; DIGIKEY: ATMEGA328-AU-ND; DIGIKEY#: ATMEGA328-AU-ND
U3 = MAAV:XC6210; DIGIKEY#: 893-1075-1-ND
U$1 U$6 = imu:CRYSTAL_403C11E16; DIGIKEY: 403C11E16M00000
U$2 = MAAV:JTAG-ARM
U$3 = ti-tiva:TM4C123GH6PM; DIGIKEY#: 296-35849-ND
U$4 = MAAV_13v1:JON_LIB_SWITCH_DPDT; DIGIKEY#: AS22AV-ND
U$5 = MAAV:POWER-MODULE-TI-6A; ANOTHER_DIGIKEY#: ED90452-ND; DIGIKEY#: 296-20515-ND
V_BATT1 = MAAV:BATT-CONN-50A; DIGIKEY: WM1942-ND

## Board
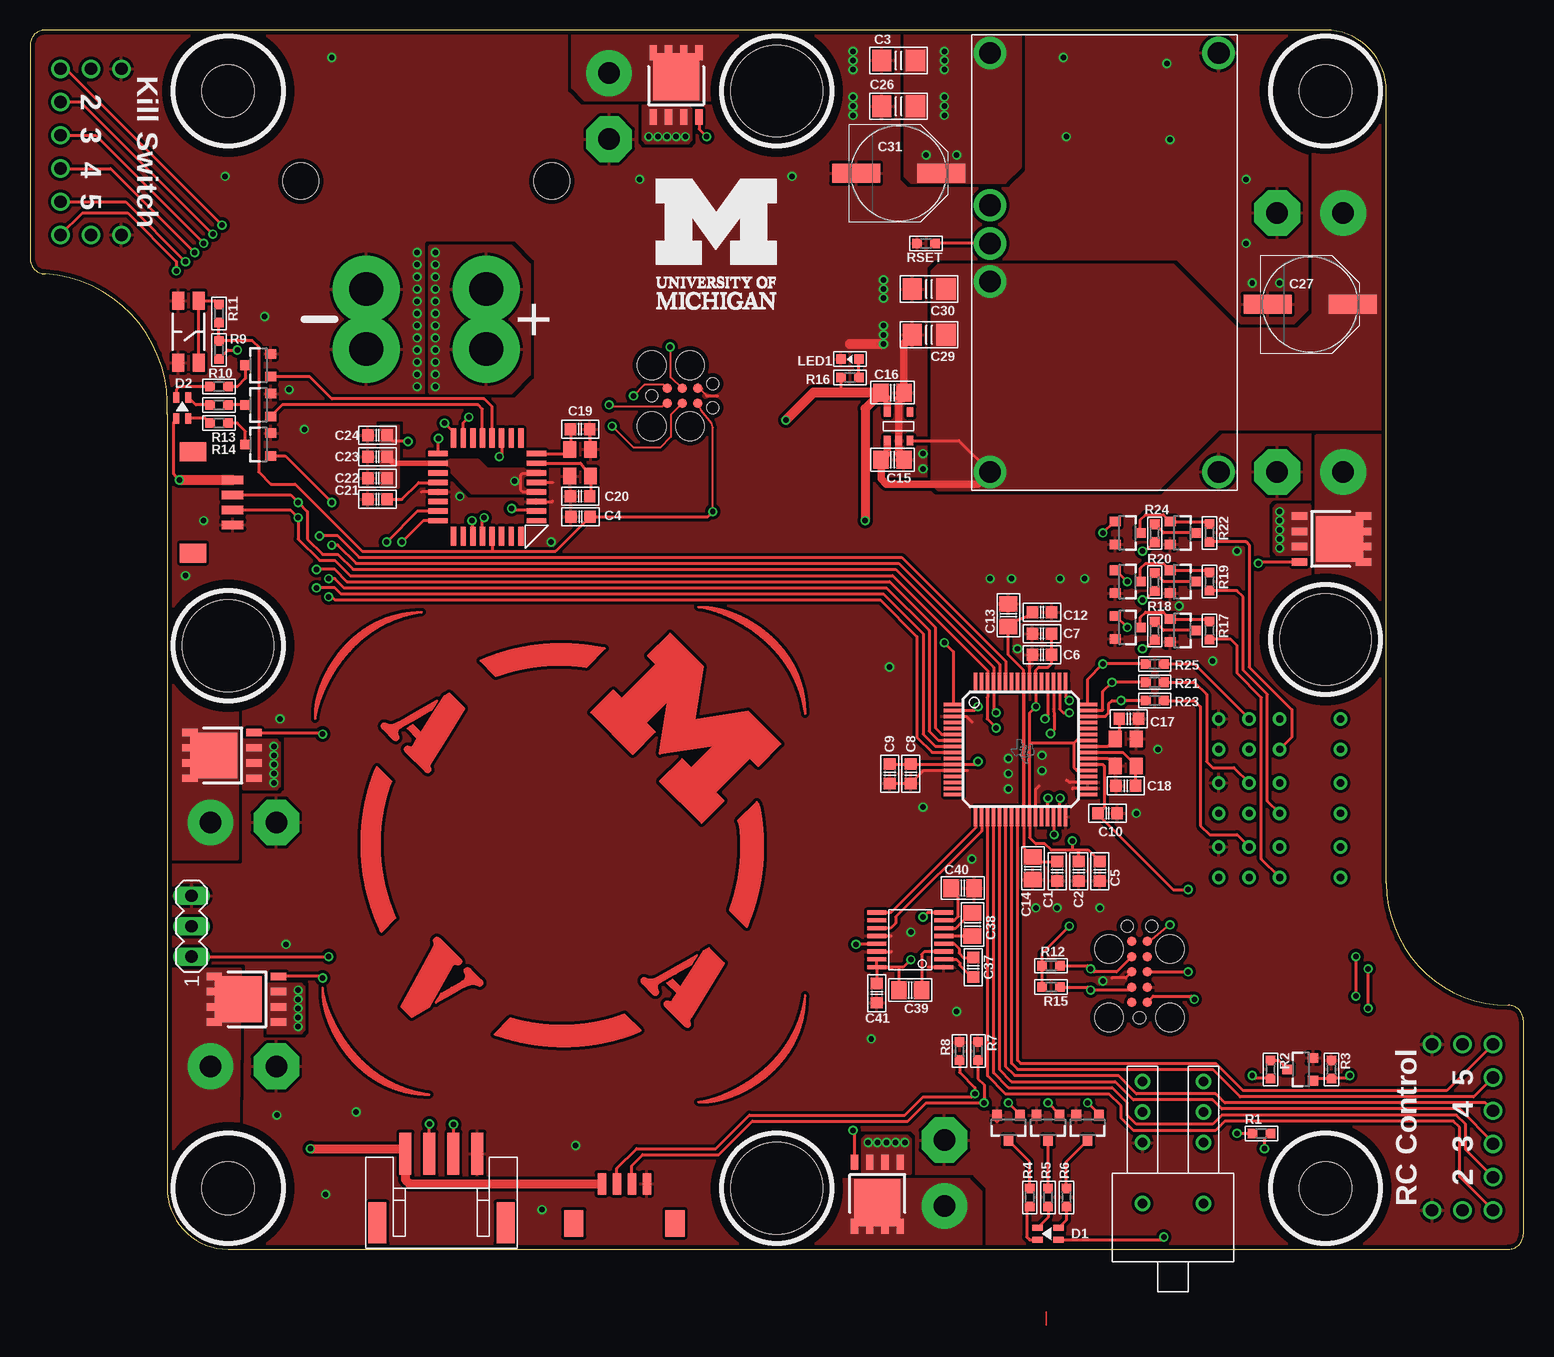
[diagram p5: board, top side]
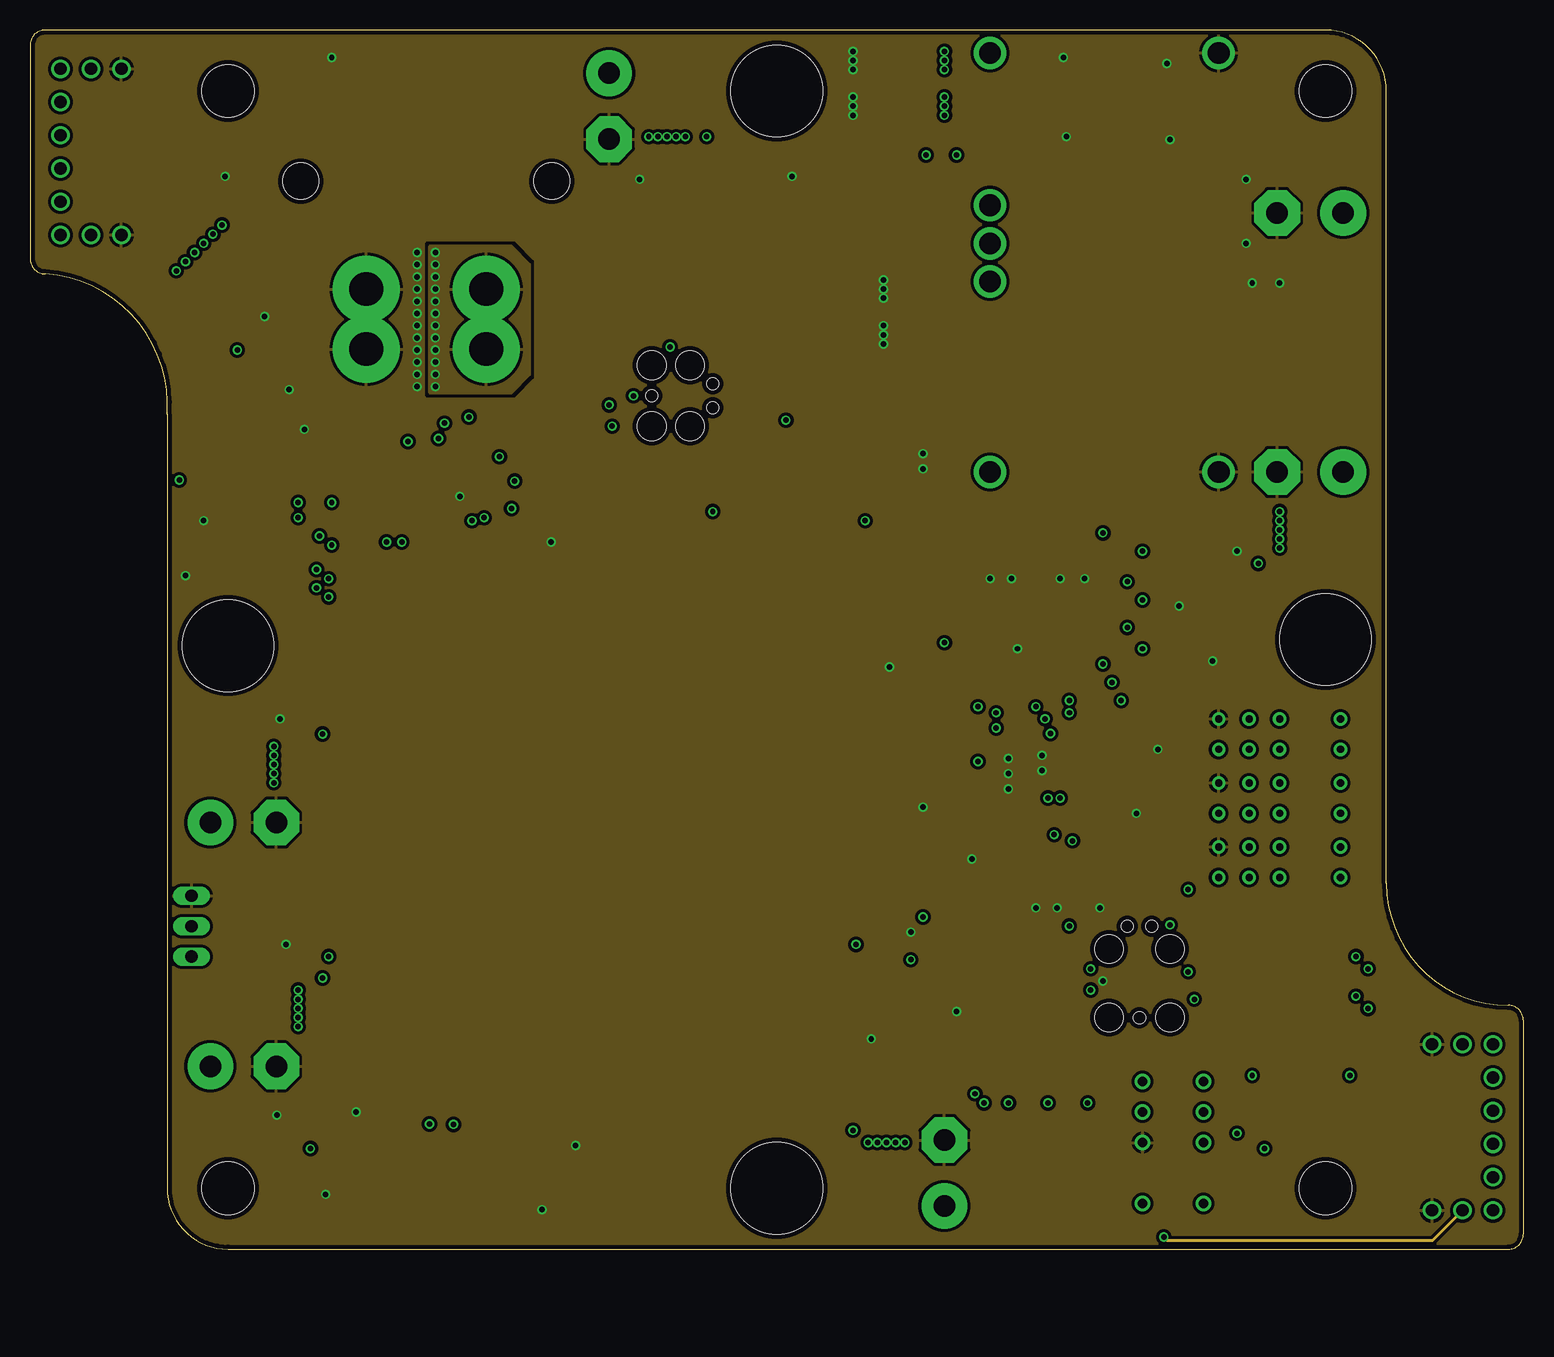
[diagram p6: board, inner layer Route2]
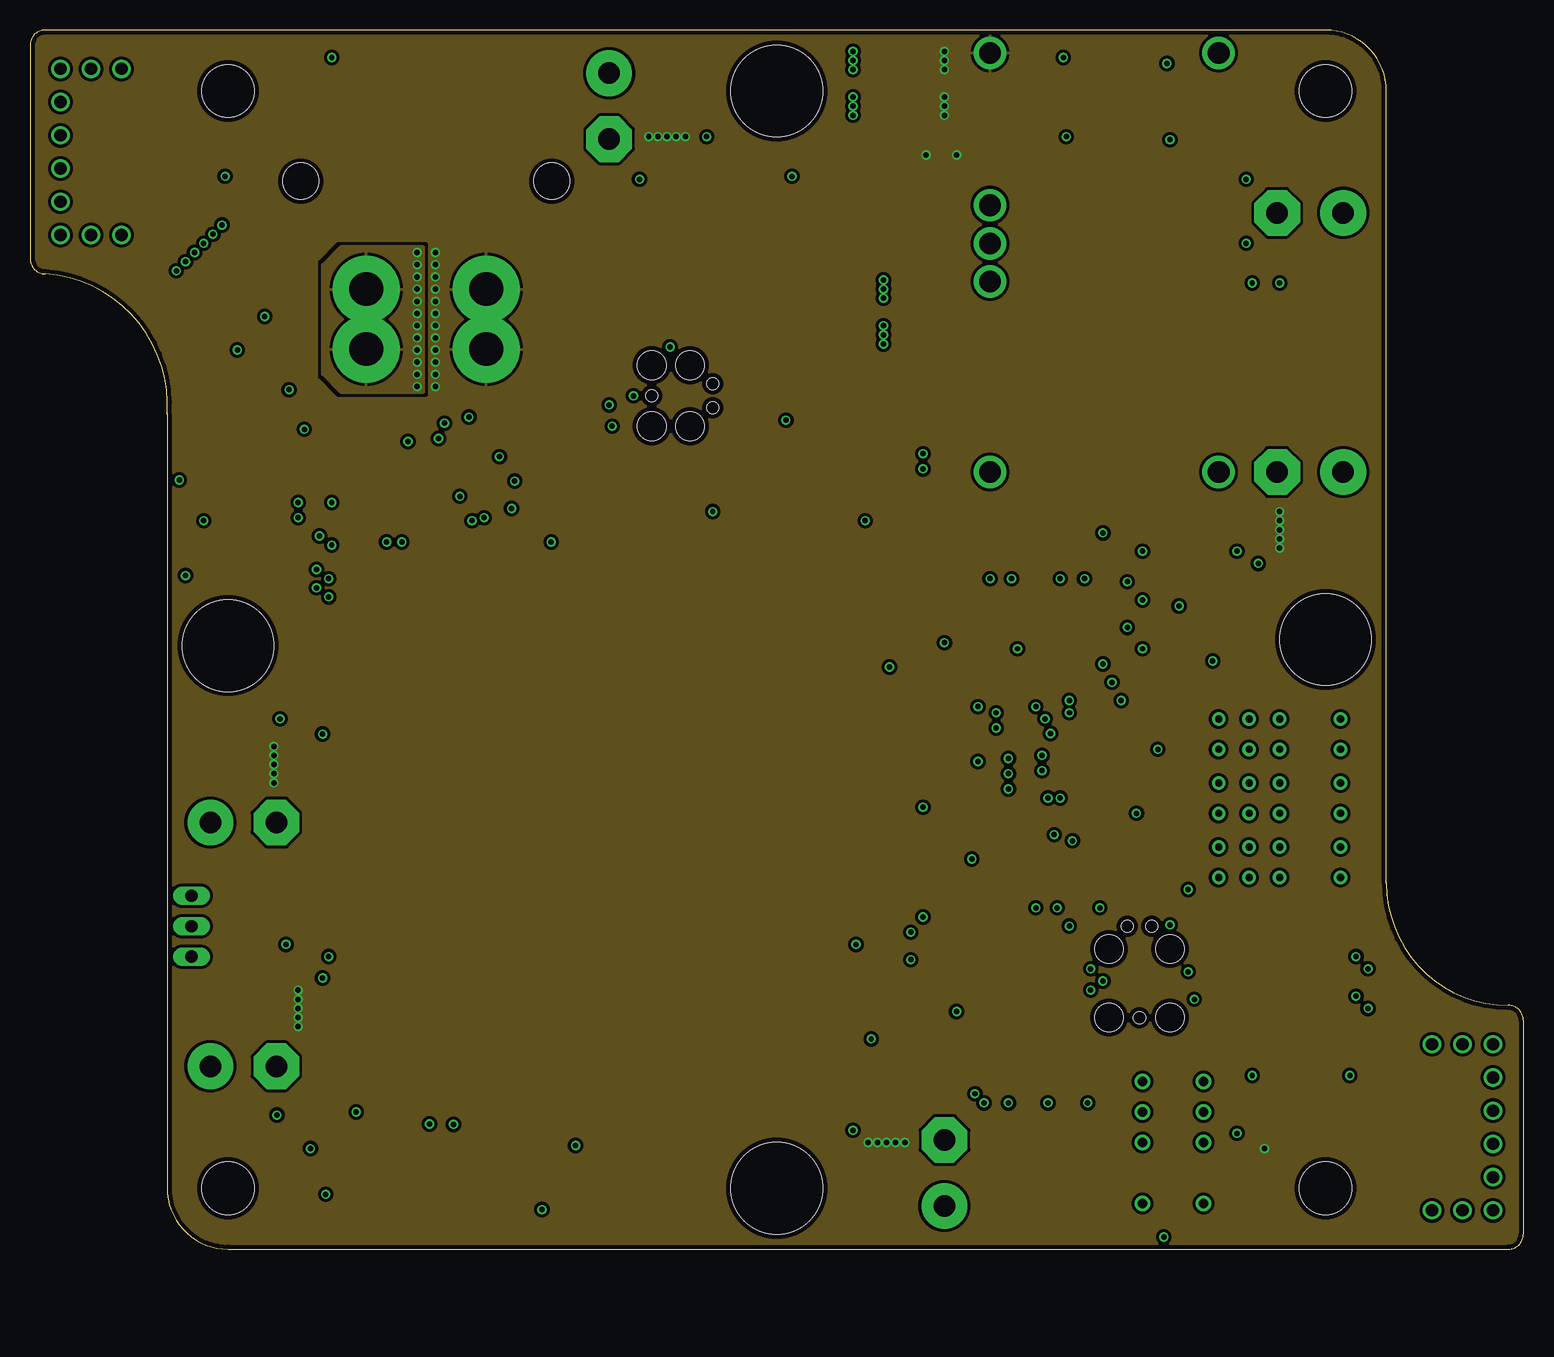
[diagram p7: board, inner layer Route15]
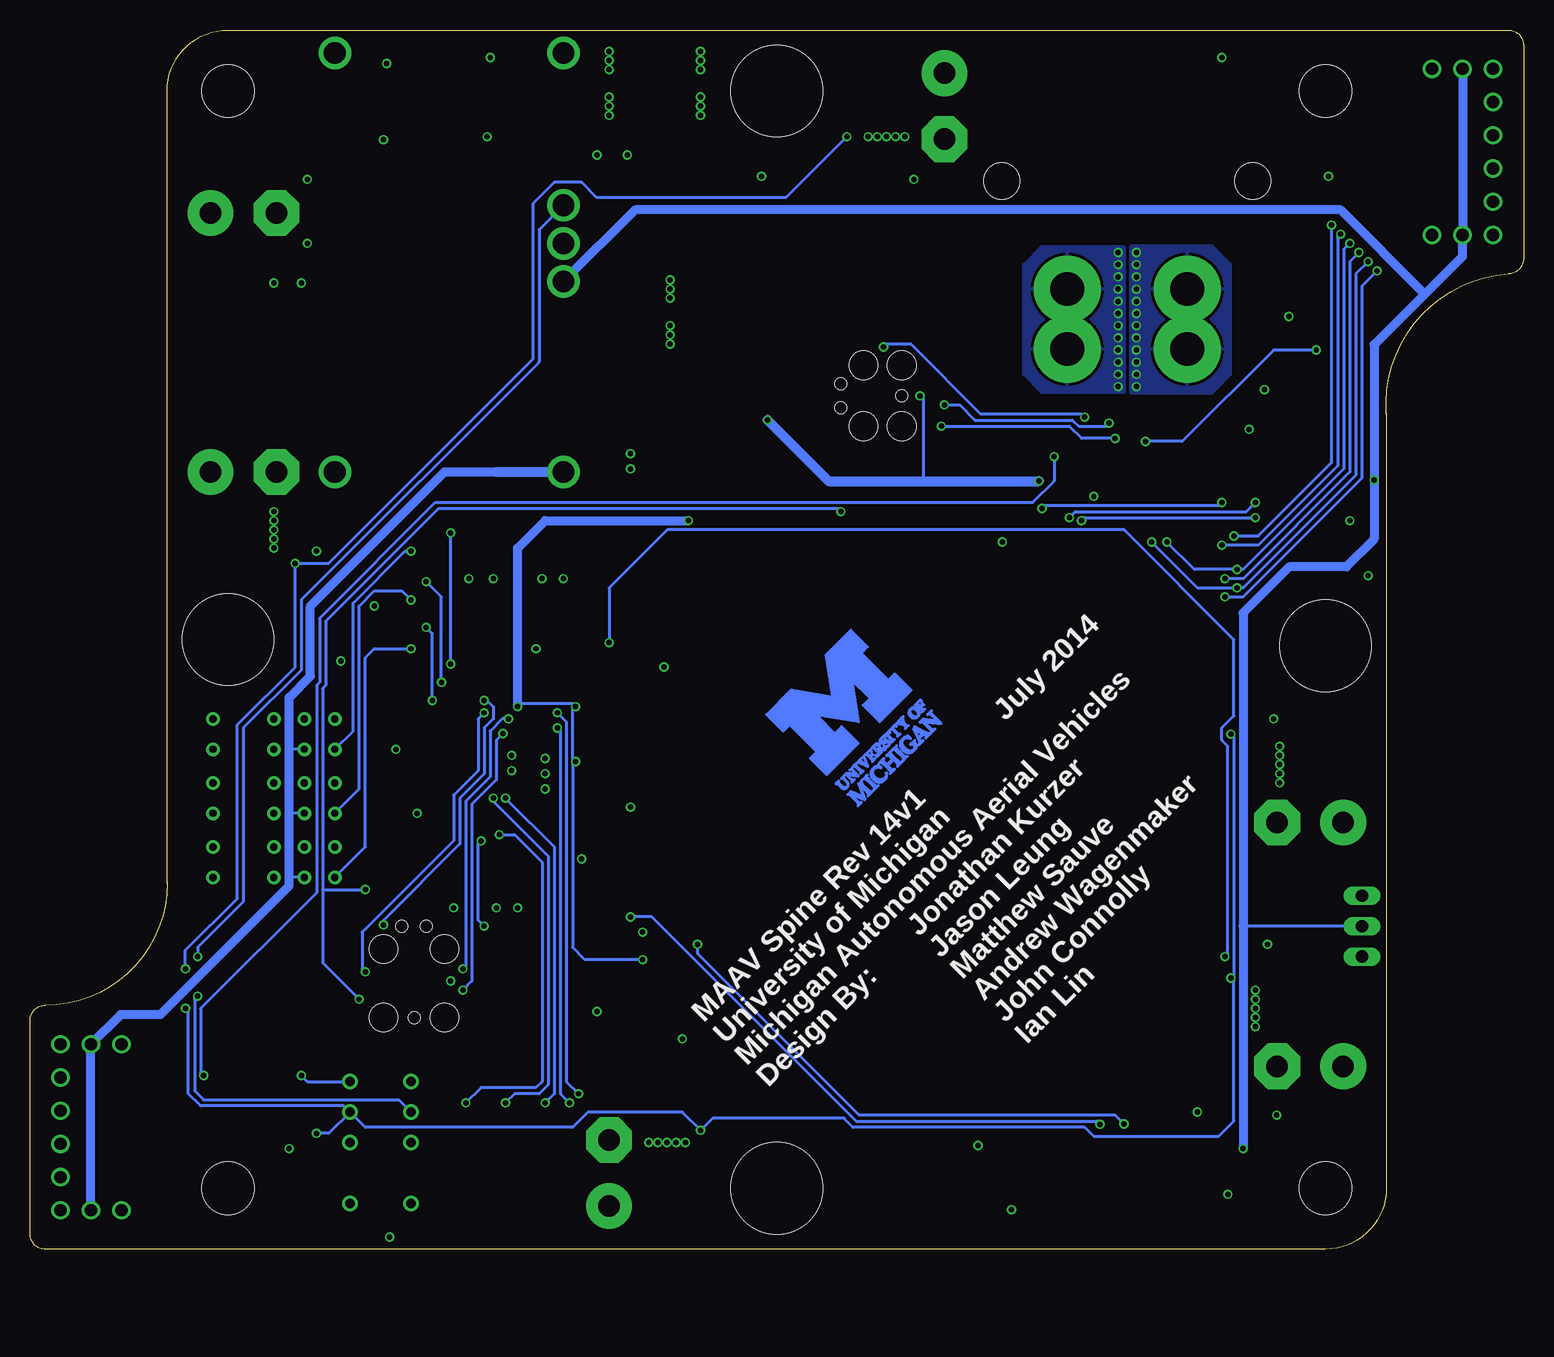
[diagram p8: board, bottom side, seen from below]

Size 124.46 x 101.6 mm. Coordinates in mm from the lower left corner, seen from the top.
Outline: 16.51,0 123.19,0 arc90 124.46,1.27 124.46,19.05 arc90 123.19,20.32 arc-90 113.03,30.48 113.03,96.52 arc90 107.95,101.6 1.27,101.6 arc90 0,100.33 0,82.55 arc90 1.27,81.28 arc-90 11.43,69.6 11.43,5.08 arc90 16.51,0
Copper layers (1+2*15+16): Top 0.035mm / dielectric 1.5mm / Route2 0.035mm / dielectric 0.15mm / Route15 0.035mm / dielectric 0.2mm / Bottom 0.035mm
Design rules "ITEADstudio_4-layer_DRC *": minimum track width 6mil, minimum drill 12mil, track to track 6mil, track to pad 6mil, pad to pad 6mil, via to via 6mil, smd to smd 6mil, copper to edge 15mil, drill to drill 15mil, minimum pad ring 10mil, minimum via ring 6mil, stop-mask expansion 3mil, vias tented up to drill 100mil, thermal gap 10mil
Holes 4.37 mm at 16.51,5.08 107.95,5.08 16.51,96.52 107.95,96.52
Holes 7.62 mm at 107.95,50.8 62.23,96.52 16.51,50.29 62.23,5.08
tKeepout: area 11.3,-0.2 to 21.7,10.3; area 11.3,91.3 to 21.7,101.8; area 102.7,91.3 to 113.2,101.8; area 102.7,-0.2 to 113.2,10.3; area 57,-0.2 to 67.5,10.3; area 57,91.3 to 67.5,101.8; area 102.7,45.6 to 113.2,56; area 11.3,45.1 to 21.7,55.5
bKeepout: area 11.3,-0.2 to 21.7,10.3; area 11.3,91.3 to 21.7,101.8; area 102.7,91.3 to 113.2,101.8; area 102.7,-0.2 to 113.2,10.3; area 57,-0.2 to 67.5,10.3; area 57,91.3 to 67.5,101.8; area 102.7,45.6 to 113.2,56; area 11.3,45.1 to 21.7,55.5
tRestrict: area 11.3,-0.2 to 21.7,10.3; area 11.3,91.3 to 21.7,101.8; area 102.7,91.3 to 113.2,101.8; area 102.7,-0.2 to 113.2,10.3; area 57,-0.2 to 67.5,10.3; area 57,91.3 to 67.5,101.8; area 102.7,45.6 to 113.2,56; area 11.3,45.1 to 21.7,55.5
bRestrict: area 11.3,-0.2 to 21.7,10.3; area 11.3,91.3 to 21.7,101.8; area 102.7,91.3 to 113.2,101.8; area 102.7,-0.2 to 113.2,10.3; area 57,-0.2 to 67.5,10.3; area 57,91.3 to 67.5,101.8; area 102.7,45.6 to 113.2,56; area 11.3,45.1 to 21.7,55.5

### Footprints (pad centres in the part's own frame; a part is rotated, then mirrored left to right if it is on the bottom)
POWER_CONN = drill 1.8 pad 3.81: P1 2.75,0 | drill 1.8 pad 3.81 octagon: P2 -2.75,0
C0603 = smd 0.95 x 1: 1 -0.8,0; 2 0.8,0
C1206 = smd 1.6 x 1.8: 1 -1.4,0; 2 1.4,0
C0805 = smd 1.3 x 1.5: 1 -0.95,0; 2 0.95,0
PANASONIC_F = smd 4 x 1.6: + 3.55,0; - -3.55,0
16-TSSOP = smd 0.35 x 1.6: P$1 -2.275,-2.8; P$2 -1.625,-2.8; P$3 -0.975,-2.8; P$4 -0.325,-2.8; P$5 0.325,-2.8; P$6 0.975,-2.8; P$7 1.625,-2.8; P$8 2.275,-2.8; P$9 2.275,2.8; P$10 1.625,2.8; P$11 0.975,2.8; P$12 0.325,2.8; P$13 -0.325,2.8; P$14 -0.975,2.8; P$15 -1.625,2.8; P$16 -2.275,2.8
LED_RGB_0606 = smd 0.85 x 0.5: 1 0.875,-0.5; 2 -0.875,-0.5; 3 -0.875,0.5; 4 0.875,0.5
MA03-1 = drill 1.016 long: 1 -2.54,0; 2 0,0; 3 2.54,0
CONN_HEADER_4POS_1.25MM_SMD = smd 0.7 x 1.8: 1 1.875,0.9; 2 0.625,0.9; 3 -0.625,0.9; 4 -1.875,0.9 | smd 1.6 x 2.2: P$1 -4.225,4.2; P$2 4.225,4.2
MA-04-SMD = smd 3.5 x 1: 1 2.875,3; 2 2.875,1; 3 2.875,-1; 4 2.875,-3 | smd 3.4 x 1.5: P$1 -2.875,-5.35; P$2 -2.875,5.35
RC_RECIEVER_RECEP = drill 1.016: GND 2.54,6.921; GND2 2.54,-6.921; P$1 -2.54,6.921; P$2 -2.54,4.153; P$3 -2.54,1.384; P$4 -2.54,-1.384; P$5 -2.54,-4.153; P$6 -2.54,-6.921; VCC 0,6.921; VCC2 0,-6.921
CHIPLED_0603 = smd 0.8 x 0.8: A -0.75,0; C 0.75,0
SOT23-3 = smd 0.8 x 0.9: 1 -0.95,-1; 2 0.95,-1; 3 0,1.1
SO-8_POWER-PAK = smd 0.61 x 1.27: D1 -1.905,2.67; D2 -0.635,2.67; D3 0.635,2.67; D4 1.905,2.67; G 1.905,-2.67; S1 -1.905,-2.67; S2 -0.635,-2.67; S3 0.635,-2.67 | smd 3.81 x 3.91: D5 0,0.69
R0603 = smd 0.8 x 0.8: 1 -0.75,0; 2 0.75,0
NKK_VERT_SWITCH_6PIN = drill 0.61: NC1 1.27,-5.08; NC2 -1.27,-5.08; P$1 1.27,5.08; P$2 1.27,2.54; P$3 1.27,0; P$4 -1.27,5.08; P$5 -1.27,2.54; P$6 -1.27,0
TACT-MOM-SMD = smd 1.5 x 1: P -2.6,0.85; P1 2.6,0.85; S -2.6,-0.85; S1 2.6,-0.85
TC2030-IDC = smd 0.787 x 0.787: 1 1.27,-0.635; 2 2.54,-0.635; 3 3.81,-0.635; 4 3.81,0.635; 5 2.54,0.635; 6 1.27,0.635 | hole 0.991: 5.08,1.016; 5.08,-1.016; 0,0 | hole 2.375: 0,2.54; 0,-2.54; 3.175,2.54; 3.175,-2.54
32-TQFP = smd 1.6 x 0.45: P$1 -4.1,2.8; P$2 -4.1,2; P$3 -4.1,1.2; P$4 -4.1,0.4; P$5 -4.1,-0.4; P$6 -4.1,-1.2; P$7 -4.1,-2; P$8 -4.1,-2.8; P$17 4.1,-2.8; P$18 4.1,-2; P$19 4.1,-1.2; P$20 4.1,-0.4; P$21 4.1,0.4; P$22 4.1,1.2; P$23 4.1,2; P$24 4.1,2.8 | smd 0.45 x 1.6: P$9 -2.8,-4.1; P$10 -2,-4.1; P$11 -1.2,-4.1; P$12 -0.4,-4.1; P$13 0.4,-4.1; P$14 1.2,-4.1; P$15 2,-4.1; P$16 2.8,-4.1; P$25 2.8,4.1; P$26 2,4.1; P$27 1.2,4.1; P$28 0.4,4.1; P$29 -0.4,4.1; P$30 -1.2,4.1; P$31 -2,4.1; P$32 -2.8,4.1
SOT-25 = smd 0.55 x 0.8: 1 -0.95,-1.2; 2 0,-1.2; 3 0.95,-1.2; 4 0.95,1.2; 5 -0.95,1.2
4-SMD-SWITCH = smd 1.372 x 1.067: 1 -1.118,-0.864; 2 1.118,-0.864; 3 1.118,0.864; 4 -1.118,0.864
TC2050-IDC = smd 0.787 x 0.787: 1 1.27,0.635; 2 2.54,0.635; 3 3.81,0.635; 4 5.08,0.635; 5 6.35,0.635; 6 6.35,-0.635; 7 5.08,-0.635; 8 3.81,-0.635; 9 2.54,-0.635; 10 1.27,-0.635 | hole 0.991: 7.62,1.016; 7.62,-1.016; 0,0 | hole 2.375: 0,2.54; 0,-2.54; 5.715,2.54; 5.715,-2.54
TM4C123GH6PM = smd 1.6 x 0.3: P$1 -5.6,3.75; P$2 -5.6,3.25; P$3 -5.6,2.75; P$4 -5.6,2.25; P$5 -5.6,1.75; P$6 -5.6,1.25; P$7 -5.6,0.75; P$8 -5.6,0.25; P$9 -5.6,-0.25; P$10 -5.6,-0.75; P$11 -5.6,-1.25; P$12 -5.6,-1.75; P$13 -5.6,-2.25; P$14 -5.6,-2.75; P$15 -5.6,-3.25; P$16 -5.6,-3.75; P$33 5.6,-3.75; P$34 5.6,-3.25; P$35 5.6,-2.75; P$36 5.6,-2.25; P$37 5.6,-1.75; P$38 5.6,-1.25; P$39 5.6,-0.75; P$40 5.6,-0.25; P$41 5.6,0.25; P$42 5.6,0.75; P$43 5.6,1.25; P$44 5.6,1.75; P$45 5.6,2.25; P$46 5.6,2.75; P$47 5.6,3.25; P$48 5.6,3.75 | smd 0.3 x 1.6: P$17 -3.75,-5.6; P$18 -3.25,-5.6; P$19 -2.75,-5.6; P$20 -2.25,-5.6; P$21 -1.75,-5.6; P$22 -1.25,-5.6; P$23 -0.75,-5.6; P$24 -0.25,-5.6; P$25 0.25,-5.6; P$26 0.75,-5.6; P$27 1.25,-5.6; P$28 1.75,-5.6; P$29 2.25,-5.6; P$30 2.75,-5.6; P$31 3.25,-5.6; P$32 3.75,-5.6; P$49 3.75,5.6; P$50 3.25,5.6; P$51 2.75,5.6; P$52 2.25,5.6; P$53 1.75,5.6; P$54 1.25,5.6; P$55 0.75,5.6; P$56 0.25,5.6; P$57 -0.25,5.6; P$58 -0.75,5.6; P$59 -1.25,5.6; P$60 -1.75,5.6; P$61 -2.25,5.6; P$62 -2.75,5.6; P$63 -3.25,5.6; P$64 -3.75,5.6
JON_LIB_SWITCH_VERT_DPDT = drill 0.8: G1 -2.54,2.54; G2 -2.54,-2.54; P$1 7.62,-2.54; P$2 5.08,-2.54; P$3 2.54,-2.54; P$4 7.62,2.54; P$5 5.08,2.54; P$6 2.54,2.54
POWER-MOD-TI-6A-SOLDERLESS-TERMINAL = drill 1.803: 1 -15.875,9.525; 2 -15.875,-9.525; 3 -3.175,-9.525; 4 0,-9.525; 5 3.175,-9.525; 6 19.05,-9.525; 7 19.05,9.525
BATT-CONN-50A = drill 2.8 pad 5.588: GND-1 5,0; GND-2 5,5; VCC-1 -5,5; VCC-2 -5,0 | hole 3: -10.452,-9; 10.452,-9

### Placement (x,y rotation side)
ATOM_POW  106.68,86.36 0 top
C1  85.6,31.5 270 top
C2  87.38,31.5 270 top
C3  72.39,99.06 180 top
C4  45.87,61.04 180 top
C5  89.15,31.5 270 top
C6  84.33,49.53 180 top
C7  84.33,51.31 180 top
C8  73.41,39.62 270 top
C9  71.63,39.62 270 top
C10  89.79,36.32 0 top
C12  84.33,53.09 0 top
C13  81.53,52.83 90 top
C14  83.57,31.75 270 top
C15  71.88,65.79 180 top
C16  71.88,71.37 0 top
C17  91.57,44.2 0 top
C18  91.31,38.61 180 top
C19  45.85,68.33 180 top
C20  45.85,62.74 0 top
C21  28.96,62.48 180 top
C22  28.96,64.26 180 top
C23  28.96,66.04 180 top
C24  28.96,67.82 180 top
C26  72.39,95.25 180 top
C27  106.68,78.74 0 top
C29  74.93,76.2 180 top
C30  74.93,80.01 180 top
C31  72.39,89.66 0 top
C37  78.61,23.5 90 top
C38  78.54,27.05 90 top
C39  73.36,21.59 180 top
C40  77.72,30.1 0 top
C41  70.56,21.34 270 top
CONV  73.36,25.78 90 top
D1  84.84,1.27 0 top
D2  12.7,70.1 270 top
DJI_POW  17.78,15.24 180 top
DJI_SIG  13.46,26.92 90 top
I2C_1  17.78,62.23 90 top
I2C_2  49.53,6.35 180 top
J7  34.29,5.08 90 top
KILL  5.08,91.44 0 top
LED1  68.33,74.17 180 top
MOUT0  76.2,6.35 270 top
MOUT1  106.68,64.77 0 top
MOUT2  48.26,95.25 90 top
MOUT3  17.78,35.56 180 top
Q1  105.92,14.99 90 top
Q2  88.14,10.16 180 top
Q3  84.84,10.16 180 top
Q4  81.53,10.16 180 top
Q5  18.03,20.83 90 top
Q6  19.05,67.06 90 top
Q7  19.05,70.36 90 top
Q8  19.05,73.66 90 top
Q9  96.01,51.56 270 top
Q10  91.44,51.82 270 top
Q11  96.01,55.63 270 top
Q12  91.44,55.63 270 top
Q13  96.01,59.69 270 top
Q14  91.44,59.69 270 top
Q21  70.61,4.57 180 top
Q22  53.85,97.03 0 top
Q23  16,41.15 90 top
Q24  108.46,59.18 270 top
R1  102.62,9.65 0 top
R2  103.38,14.99 270 top
R3  108.46,14.99 270 top
R4  83.31,4.32 270 top
R5  84.84,4.32 270 top
R6  86.36,4.32 270 top
R7  78.99,16.51 270 top
R8  77.47,16.51 270 top
R9  15.75,74.93 270 top
R10  15.75,71.88 180 top
R11  15.75,77.98 270 top
R12  85.09,23.62 180 top
R13  15.75,70.36 180 top
R14  15.75,68.83 180 top
R15  85.09,21.84 180 top
R16  68.33,72.64 180 top
R17  98.3,51.56 270 top
R18  93.73,51.54 270 top
R19  98.3,55.63 270 top
R20  93.73,55.6 270 top
R21  93.73,47.24 0 top
R22  98.3,59.69 270 top
R23  93.73,45.72 0 top
R24  93.73,59.66 270 top
R25  93.73,48.77 0 top
RC  119.38,10.16 180 top
RSET  74.68,83.82 180 top
S1  104.14,32.26 90 top
S2  104.14,37.59 90 top
S3  104.14,42.93 90 top
S_R  13.21,76.45 270 top
SV1  51.82,71.12 0 top
U1  38.1,63.5 180 top
U3  72.39,68.58 0 top
U$1  91.31,41.4 270 top
U$2  92.46,19.3 90 top
U$3  82.55,41.66 0 top
U$4  95.25,6.35 90 top
U$5  89.53,83.82 270 top
U$6  45.85,65.53 270 top
U$7  [BLOCK-M-DOUBLE-STACKED-10MM-MASK]  55.37,43.94 45 bottom
U$8  [MAAVLOGO_50MM_MASK_ONLY]  44.45,33.02 315 top
U$9  [BLOCK-M-DOUBLE-STACKED-10MM]  57.15,83.31 0 top
V_BATT1  33.02,80.01 180 top

### Tracks (layer width: path | path; a pad name or v marks a point on that pad's centre or on a via)
5V_ENABLE  (via drill 0.46)
  Top 0.254: v110.49,24.38 v110.49,21.08
  Bottom 0.254: U$5.3 82.04,84.96 82.04,73.91 101.85,54.1 101.85,48.26 106.68,43.43 106.68,28.96 110.49,25.15 v110.49,24.38 | U$4.P$5 93.73,12.45 109.98,12.45 110.74,13.21 110.74,20.83 v110.49,21.08
+3V3  (via drill 0.46)
  Top 0.152: SV1.6 52.81,72.03 51.21,72.03 v50.29,71.12
  Top 0.254: U1.P$4 41.04,63.1 40.89,63.25 40.89,64.52 41.02,64.64 42.14,64.64 U1.P$6 | C7.1 C6.1 85.13,48.81 84.84,48.51 84.07,48.51 83.8,48.24 U$3.P$54 83.8,45.23 v83.82,45.21 83.3,44.69 83.3,42.16 | 86.87,33.27 85.09,33.27 84.58,33.78 83.82,33.78 83.3,34.3 U$3.P$26 83.3,42.16 | 86.87,33.27 87.38,33.27 | 87.38,33.27 88.18,33.27 C5.1 | C2.1 87.38,33.27 | R9.2 16.5,74.93 v17.27,74.93 | CONV.P$16 CONV.P$15 | U$3.P$42 87.24,42.41 87,42.16 | 87,42.16 87,40.13 87.22,39.91 U$3.P$37 | R16.2 67.58,71.39 67.56,71.37 | v31.5,67.31 30.26,67.31 C24.1 | 87,42.16 83.3,42.16 | C9.1 C8.1 73.42,40.41 U$3.P$11 78.76,40.41 v78.99,40.64 | U$3.P$2 78.69,44.91 v78.99,45.21 | CONV.P$16 71.95,23.51 | C39.2 72.41,23.49 72.39,23.51 | CONV.P$16 C41.1 | v73.41,24.13 72.78,23.51 72.39,23.51 | 72.39,23.51 CONV.P$16 | R15.2 R12.2 84.34,24.65 v86.61,26.92 | v86.87,34.04 86.87,33.27
  Top 0.406: 29.76,64.23 C22.1
  Top 0.457: U1.P$18 30.3,65.5 C23.1
  Top 0.61: C16.1 71.44,70.87 U3.5
  Top 0.762: v69.6,60.71 69.6,70.04 C16.1
  Top 0.813: C16.1 67.56,71.37 65.28,71.37 v62.99,69.09
  Bottom 0.254: v50.29,71.12 50.04,70.87 50.04,64.01 | v17.27,74.93 20.83,74.93 28.45,67.31 v31.5,67.31 | v83.82,45.21 83.57,45.47 79.25,45.47 v78.99,45.21 79.25,44.96 79.25,40.89 v78.99,40.64 79.25,40.39 79.25,25.15 78.23,24.13 v73.41,24.13 | v86.61,26.92 87.12,27.43 87.12,33.78 v86.87,34.04
  Bottom 0.762: v83.82,45.21 83.82,58.42 81.53,60.71 v69.6,60.71
  Bottom 0.813: v62.99,69.09 57.91,64.01 50.04,64.01 v40.39,64.01
  pour Top (no thermals): 29.21,68.58 29.21,63.5 30.73,63.5 30.73,68.58
  pour Top (isolate 0.254, no thermals): 42.42,62.99 36.83,62.99 34.8,65.02 34.8,65.79 37.34,65.79 38.1,65.02 42.42,65.02
+5V  (via drill 0.46)
  Top 0.254: U3.3 77.4,67.38 U$5.6 | D1.1 94.24,0.77 v94.49,1.02 | D2.1 11.94,68.83 11.94,64.64 12.2,64.35 v12.45,64.11
  Top 0.61: U3.1 71.44,66.29 C15.2 70.93,64.2 71.37,63.75 78.99,63.75 U$5.6
  Top 0.762: J7.1 31.29,5.79 31.63,5.45 I2C_2.1 | v23.37,8.38 31.29,8.38
  Top 0.813: 31.29,8.38 J7.1 | v12.45,64.11 I2C_1.1
  Route2 0.254: v94.49,1.02 94.74,0.76 116.9,0.76 RC.VCC
  Bottom 0.254: S1.P$5 102.87,30.99 | S2.P$5 102.87,36.32 | S3.P$5 102.87,41.66 | DJI_SIG.2 23.37,26.92
  Bottom 0.762: RC.VCC RC.VCC2 116.9,19.56 113.6,19.56 102.87,30.29 102.87,30.99 102.87,36.32 102.87,41.66 102.87,45.97 101.09,47.75 101.09,53.59 89.92,64.77 85.6,64.77 | v23.37,8.38 23.37,26.92 23.37,53.02 19.53,56.86 14.76,56.86 12.45,59.18 v12.45,64.11 12.45,75.37 8.22,79.6 | KILL.VCC KILL.VCC2 5.08,82.74 8.22,79.6 | U$5.5 74.04,86.61 15.24,86.61 8.22,79.6
  Bottom 0.813: 85.6,64.77 U$5.6
  pour Top (no thermals): 114.05,96.77 114.05,68.33 99.06,68.33 93.98,63.25 75.69,63.25 75.18,63.75 75.18,81.53 75.69,82.04 95.25,82.04 100.58,76.71 105.66,76.71 106.93,77.98 106.93,96.77
A_AREF
  Top 0.254: C21.1 30.99,62.48 32.38,63.88 33.98,63.88
  Top 0.406: 33.98,63.88 U1.P$20
A_XTAL1
  Top 0.254: U1.P$7 45.88,65.5 U$6.3 46.71,62.8 C20.2
A_XTAL2
  Top 0.254: U1.P$8 44.63,66.3 U$6.1 45.05,66.71 C19.2
DJI_PPM  (via drill 0.46)
  Top 0.254: DJI_SIG.1 v24.89,24.38 | v76.2,50.55 76.95,49.8 U$3.P$1
  Bottom 0.254: v24.89,24.38 24.64,24.64 24.64,41.91 25.15,42.42 25.15,43.43 24.13,44.45 24.13,50.8 33.27,59.94 71.37,59.94 76.2,55.12 v76.2,50.55
GND  (via drill 0.46)
  Top 0.152: 55.75,71.75 56.39,71.12
  Top 0.254: U$1.2 89.83,40.91 U$3.P$39 | 44.98,62.8 C20.1 | C19.1 46.65,66.71 U$6.4 | 44.72,63.9 U$6.2 | U$3.P$55 83.3,49.3 C6.2 | S_R.S1 12.36,73.62 | 55.63,72.01 SV1.4 55.75,71.75 | 78.1,39.88 78.08,39.91 U$3.P$12 74.49,39.91 C8.2 C9.2 | CONV.P$12 71.76,26.11 | CONV.P$14 71.79,24.81 | CONV.P$1 74.89,23.51 | 56.39,71.12 57.28,71.12 | U1.P$5 43.54,63.9 43.56,63.88 | U1.P$3 43.5,62.3 43.56,62.36 | 33.98,63.12 32.64,63.12 | U$3.P$35 86.66,38.91 86.36,39.12 | U$3.P$34 86.92,38.41 86.87,38.35 | U$3.P$27 83.8,38.33 84.07,38.61 | U$3.P$3 78.02,44.41 78.49,43.94 | U$2.3 91.31,22.61 90.17,22.61
  Top 0.406: 33.98,63.12 U1.P$21 | Q4.2 80.58,10.73
  Top 0.61: C15.1 72.39,66.23 U3.2 72.39,70.93 C16.2 72.83,75.5 C29.2
  Top 0.813: 68.33,75.44 v71.12,75.44
  other vias: 71.12,76.2 71.12,76.96 71.12,80.01 71.12,79.25 71.12,80.77 68.58,95.25 68.58,94.49 68.58,96.01 68.58,99.06 68.58,98.3 68.58,99.82 101.35,89.15 104.14,80.52 101.35,83.82 101.85,80.52 32.26,81.03 32.26,80.01 32.26,78.99 32.26,77.98 32.26,76.96 32.26,75.95 32.26,82.04 32.26,83.06 32.26,74.93 32.26,73.91 32.26,72.9 32.26,71.88 74.42,66.29 74.42,65.02 22.86,68.33 21.59,71.63 78.49,32.51 81.53,38.35 81.53,39.62 81.53,40.89 84.33,41.15 84.33,39.88 71.63,48.51 92.2,36.32 93.98,41.66 80.01,55.88 81.79,55.88 85.85,55.88 87.88,55.88 82.3,50.04 89.41,22.35 77.22,19.81 70.1,17.53 45.47,8.64 27.18,11.43 24.64,4.57 20.57,11.18 21.34,25.4 20.83,44.2 12.95,56.13 14.48,60.71 19.56,77.72 16.26,89.41 25.15,99.31 50.8,89.15 63.5,89.41 100.58,58.17 95.76,53.59 98.55,49.02 42.67,3.3 74.42,36.83 73.41,26.42 83.82,28.45 85.6,28.45 89.15,28.45 43.43,58.93 35.81,62.74 94.74,98.81 86.11,99.31 86.36,92.71 95,92.46
  pour Route2 (isolate 0.254, rank 6): -1.4,-1.27 -1.4,102.87 125.73,102.87 125.73,-1.27
  pour Top (isolate 0.254, rank 6): -2.16,-1.27 -2.16,102.87 125.73,102.87 125.73,-1.27
  pour Route2: 32.77,83.57 32.77,71.37 25.91,71.37 24.38,72.9 24.38,82.04 25.91,83.57
  pour Route15: 32.77,83.57 32.77,71.37 25.91,71.37 24.38,72.9 24.38,82.04 25.91,83.57
  pour Bottom: 32.77,83.57 32.77,71.37 25.91,71.37 24.38,72.9 24.38,82.04 25.91,83.57
ICDI_TCK  (via drill 0.46)
  Top 0.254: U$3.P$52 84.8,44.49 v84.58,44.2 | U$2.4 90.55,23.11 88.65,23.11 v88.39,23.37 88.14,23.62 R12.1
  Bottom 0.254: v84.58,44.2 85.09,44.2 86.11,43.18 86.11,39.37 88.14,37.34 88.14,23.62 v88.39,23.37
ICDI_TDI  (via drill 0.46)
  Top 0.254: U$3.P$50 85.8,45.01 86.11,44.7 v86.61,44.7 | U$2.8 v96.52,23.11
  Bottom 0.254: v86.61,44.7 87.12,44.2 87.12,39.88 89.15,37.85 89.15,34.04 96.77,26.42 96.77,23.37 v96.52,23.11
ICDI_TDO  (via drill 0.46)
  Top 0.152: v95,27.03 93.47,25.81 U$2.6
  Top 0.254: U$3.P$49 86.3,46.03 v86.61,45.72
  Bottom 0.254: v86.61,45.72 86.36,45.72 85.85,45.21 85.85,44.2 86.61,43.43 86.61,39.62 88.65,37.59 88.65,33.78 95,27.43 v95,27.03
ICDI_TMS  (via drill 0.46)
  Top 0.254: U$3.P$51 85.3,45 85.34,44.45 85.34,43.27 v85.05,42.97 | U$2.2 91.57,21.59 v88.39,21.59 88.14,21.84 R15.1
  Bottom 0.254: v85.05,42.97 85.6,42.42 85.6,39.12 87.63,37.08 87.63,22.35 v88.39,21.59
KILL_1  (via drill 0.46)
  Top 0.254: v16,85.34 2.98,98.36 KILL.P$1 | v24.13,59.44 25.65,59.44 27.43,57.66 72.64,57.66 81.3,49 U$3.P$59
  Bottom 0.254: v16,85.34 16,65.53 22.1,59.44 v24.13,59.44
KILL_2  (via drill 0.46)
  Top 0.254: v15.24,84.58 4.23,95.59 KILL.P$2 | v25.15,58.67 25.65,58.67 27.18,57.15 72.39,57.15 80.8,48.74 U$3.P$60
  Bottom 0.254: v15.24,84.58 15.49,84.33 15.49,65.28 22.1,58.67 v25.15,58.67
KILL_4  (via drill 0.46)
  Top 0.254: v13.72,83.06 6.72,90.06 KILL.P$4 | 76.94,42.42 U$3.P$7 75.7,42.41 74.93,43.18 74.93,51.56 71.37,55.12 26.16,55.12 25.4,55.88 v24.89,55.88
  Bottom 0.254: v13.72,83.06 14.48,82.3 14.48,64.77 23.37,55.88 v24.89,55.88
KILL_5  (via drill 0.46)
  Top 0.254: KILL.P$5 7.96,87.29 v12.95,82.3 | U$3.P$8 75.44,41.91 74.42,42.93 74.42,51.31 71.12,54.61 25.91,54.61 25.4,55.12 v23.88,55.12 | U1.P$24 32.76,60.7 v30.99,58.93
  Bottom 0.254: v12.95,82.3 13.97,81.28 13.97,64.52 23.37,55.12 v23.88,55.12 27.18,55.12 v30.99,58.93
KILL_6  (via drill 0.46)
  Top 0.254: KILL.P$6 4.38,86.36 8.13,86.36 12.19,82.3 v12.19,81.53 | U$3.P$9 75.18,41.41 73.91,42.67 73.91,51.05 70.87,54.1 25.4,54.1 25.15,54.36 v24.89,54.36
  Bottom 0.254: v12.19,81.53 13.46,80.26 13.46,64.26 23.37,54.36 v24.89,54.36
KILL_SIG  (via drill 0.46)
  Top 0.254: v14.48,83.82 5.47,92.82 KILL.P$3 | 76.93,42.93 U$3.P$6 75.97,42.91 75.44,43.43 75.44,51.82 71.63,55.63 26.42,55.63 25.4,56.64 v23.88,56.64 | U1.P$23 32.29,61.5 v29.72,58.93
  Bottom 0.254: v14.48,83.82 14.99,83.31 14.99,65.02 23.37,56.64 v23.88,56.64 27.43,56.64 v29.72,58.93
LED1
  Top 0.254: U1.P$12 38.5,70.21 37.85,70.87 25.15,70.87 23.3,72.71 Q8.1 20.25,72.71
LED2
  Top 0.254: U1.P$13 37.7,70 37.34,70.36 21,70.36 Q7.1
LED3  (via drill 0.46)
  Top 0.254: U1.P$2 42.11,61.59 40.26,61.59 v40.13,61.72 | Q6.1 21.27,66.11 v25.15,62.23
  Bottom 0.254: v40.13,61.72 39.88,61.98 25.4,61.98 v25.15,62.23
M_EN_PRE  (via drill 0.46)
  Top 0.254: R2.2 102.1,14.24 v101.85,14.48
  Bottom 0.254: v101.85,14.48 101.35,13.97 U$4.P$1
M_ENABLE  (via drill 0.46)
  Top 0.254: v100.58,9.65 R1.1 | Q22.G 55.75,93.34 v56.39,92.71 | Q24.G 102.49,57.28 v102.36,57.15 | Q21.G 68.71,10.03 v68.58,9.91 | v111.51,20.07 v111.51,23.37 | v24.38,22.61 24.26,22.73 Q5.G | Q23.G 24.26,43.05 v24.38,42.93
  Bottom 0.254: U$4.P$2 99.57,9.65 v100.58,9.65 | v56.39,92.71 61.47,87.63 77.22,87.63 78.49,88.9 80.77,88.9 82.55,87.12 82.55,74.17 99.57,57.15 v102.36,57.15 102.36,48.51 107.19,43.69 107.19,29.21 111.51,24.89 v111.51,23.37 | U$4.P$2 96.52,10.16 79.25,10.16 77.98,11.43 70.1,11.43 v68.58,9.91 67.56,10.92 56.64,10.92 55.88,10.16 36.58,10.16 35.81,9.4 25.4,9.4 24.13,10.67 24.13,22.35 v24.38,22.61 24.13,22.86 24.13,42.67 v24.38,42.93 | U$4.P$2 98.3,11.94 110.24,11.94 111.25,12.95 111.25,19.81 v111.51,20.07
MISO  (via drill 0.46)
  Top 0.152: SV1.1 52.7,70.21 48.51,70.21 v48.26,70.36
  Top 0.254: U1.P$16 35.3,68.07 v34.54,68.83
  Bottom 0.254: v48.26,70.36 46.99,70.36 45.72,69.09 37.59,69.09 37.08,68.58 34.8,68.58 v34.54,68.83
MOSI  (via drill 0.46)
  Top 0.152: SV1.5 53.39,72.64 53.39,75.06 v53.34,75.18
  Top 0.254: U1.P$15 36.1,68.87 v36.58,69.34
  Bottom 0.254: v53.34,75.18 53.09,75.44 51.05,75.44 45.21,69.6 36.83,69.6 v36.58,69.34
MOTOR_LOGIC  (via drill 0.46)
  Top 0.254: U1.P$11 39.3,66.22 v39.12,66.04 | v109.98,14.48 109.74,14.24 R3.2 107.12,14.24 Q1.1
  Bottom 0.254: v39.12,66.04 39.12,64.01 40.89,62.23 90.68,62.23 100.33,52.58 100.33,47.24 100.58,46.99 100.58,29.72 110.24,20.07 110.24,14.73 v109.98,14.48
N$1
  Top 0.254: R2.1 104.07,15.74 Q1.3
N$2
  pour Top (isolate 0.254, no thermals): 62.23,5.84 78.23,5.84 79.25,4.83 79.25,-1.02 62.23,-1.02
N$3
  Top 0.254: R4.1 83.31,7.28 Q4.3
N$4
  Top 0.254: R5.1 Q3.3
N$5
  Top 0.254: R6.1 86.36,7.28 Q2.3
N$6
  Top 0.254: R4.2 83.06,3.31 83.06,1.02 83.3,0.77 D1.2 83.81,0.77
N$7
  Top 0.254: R5.2 84.84,2.65 D1.3
N$8
  Top 0.254: R16.1 LED1.A
N$9
  Top 0.254: Q10.3 92.54,52.66 92.96,53.09 94.44,53.09 Q9.1 98.1,52.51 R17.1
N$10
  Top 0.254: S_R.P1 S_R.P 15.42,79.05 R11.1
N$11
  Top 0.254: CONV.P$2 77.19,24.16 77.47,23.88 77.47,23.67 78.45,22.7 C37.1
N$12
  Top 0.254: Q8.3 17.95,72.56 17.27,71.88 R10.1
N$13
  Top 0.254: CONV.P$3 74.54,24.81 74.31,24.57 C39.1
N$14
  Top 0.254: CONV.P$7 77.04,27.41 77.37,27.74 77.37,29.5 C40.1
N$15
  pour Top (isolate 0.254, no thermals): 107.19,50.8 107.19,67.82 114.05,67.82 114.05,50.8
N$16
  pour Top (isolate 0.254, no thermals): 62.23,95.76 46.23,95.76 45.21,96.77 45.21,102.62 62.23,102.62
N$17
  pour Top (isolate 0.254, no thermals): 17.27,50.55 17.27,32.51 10.41,32.51 10.41,50.55
N$18
  Top 0.254: U$5.4 RSET.1
N$19
  Top 0.254: R6.2 86.36,2.42 D1.4
N$20
  Top 0.254: Q7.3 R13.1
N$21
  pour Top (isolate 0.254, no thermals): 17.53,23.37 17.27,5.08 10.67,5.08 10.67,23.37
N$22
  Top 0.254: Q6.3 17.95,68.16 17.27,68.83 R14.1
N$23
  Top 0.254: R10.2 12.45,71.88 12.2,71.64 D2.2
N$24
  Top 0.254: R13.2 13.82,70.36 D2.3
N$25
  Top 0.254: R14.2 14.6,69.23 D2.4
N$26
  Top 0.254: Q9.3 94.48,51.56 R18.1
N$27
  Top 0.254: Q12.3 92.54,56.73 92.96,57.15 94.44,57.15 Q11.1 98.1,56.58 R19.1
N$28
  Top 0.254: Q11.3 94.48,55.63 R20.1
N$29
  Top 0.254: S2.P$6 103.12,37.34 103.12,46.23 101.09,48.26 101.09,54.36 100.57,54.88 R19.2
N$30  (via drill 0.46)
  Top 0.254: R20.2 92.95,54.1 v92.71,54.1
  Bottom 0.254: S2.P$4 97.03,38.35 97.03,53.59 95.76,54.86 93.47,54.86 v92.71,54.1
N$31
  Top 0.254: S1.P$2 100.58,34.54 98.3,34.54 97.54,35.31 97.54,45.21 97.03,45.72 R23.2
N$32
  Top 0.254: CONV.P$4 77.01,25.46 77.42,25.04 77.42,24.66 77.79,24.3 C37.2
N$33
  Top 0.254: R21.2 97.03,47.24 98.04,46.23 98.04,40.64 98.55,40.13 100.33,40.13 S2.P$2
N$34
  Top 0.254: S1.P$6 102.62,32.51 102.62,45.97 100.58,48.01 100.58,50.29 100.06,50.81 R17.2
N$35
  Top 0.254: CONV.P$5 78.49,26.11 C38.1
N$36
  Top 0.254: CONV.P$6 77.15,26.76 78.4,28 C38.2
N$37  (via drill 0.46)
  Top 0.254: R18.2 92.95,50.04 v92.71,50.04
  Bottom 0.254: S1.P$4 96.52,33.53 96.52,49.28 95.76,50.04 v92.71,50.04
N$38
  Top 0.127: 84.68,-5.23 84.68,-6.33
N$39
  Top 0.254: Q14.3 92.54,60.79 92.96,61.21 94.44,61.21 Q13.1 98.1,60.64 R22.1
N$40
  Top 0.254: Q13.3 94.48,59.69 R24.1
N$41
  Top 0.254: S3.P$6 105.16,42.67 105.16,44.96 101.6,48.51 101.6,58.67 101.33,58.94 R22.2
N$42  (via drill 0.46)
  Top 0.254: R24.2 92.95,58.17 v92.71,58.17
  Bottom 0.254: S3.P$4 97.54,43.18 97.54,53.85 93.22,58.17 v92.71,58.17
N$43
  Top 0.254: R25.2 97.03,48.77 S3.P$2
OPT_SWITCH_1  (via drill 0.46)
  Top 0.254: U$3.P$46 89.62,44.41 89.92,44.7 89.92,45.47 90.17,45.72 v90.93,45.72 R23.1 | v91.44,51.82 90.49,52.77 Q10.1
  Bottom 0.254: v90.93,45.72 90.93,51.31 v91.44,51.82
OPT_SWITCH_2  (via drill 0.46)
  Top 0.254: U$3.P$47 89.36,44.91 89.41,44.96 89.41,46.48 v90.17,47.24 R21.1 | v91.44,55.63 90.49,56.58 Q12.1
  Bottom 0.254: v90.17,47.24 90.17,54.36 v91.44,55.63
OPT_SWITCH_3  (via drill 0.46)
  Top 0.254: U$3.P$48 88.15,47.51 v89.41,48.77 R25.1 | v89.41,59.69 90.36,60.64 Q14.1
  Bottom 0.254: v89.41,48.77 v89.41,59.69
RC_1
  Top 0.254: RC.P$1 119.13,6.03 119.13,10.16 118.62,10.67 99.57,10.67 98.81,9.91 91.95,9.91 90.93,10.92 90.93,11.94 89.92,12.95 81.28,12.95 79.8,14.43 U$3.P$19
RC_2
  Top 0.254: RC.P$2 119.63,8.29 119.63,10.41 118.87,11.18 99.31,11.18 98.55,10.41 92.2,10.41 91.44,11.18 91.44,12.19 90.17,13.46 81.53,13.46 80.3,14.7 U$3.P$20
RC_3
  Top 0.254: RC.P$3 121.92,8.89 119.13,11.68 99.31,11.68 98.55,12.45 91.95,12.45 90.42,13.97 81.79,13.97 80.8,14.96 U$3.P$21
RC_4
  Top 0.254: RC.P$4 121.27,12.19 99.57,12.19 98.81,12.95 92.2,12.95 90.68,14.48 82.04,14.48 81.3,15.22 U$3.P$22
RC_5
  Top 0.254: RC.P$5 120.31,12.7 100.84,12.7 98.55,14.99 82.3,14.99 81.8,15.48 U$3.P$23
RC_6
  Top 0.254: RC.P$6 118.05,13.21 101.09,13.21 98.81,15.49 82.55,15.49 82.3,15.74 U$3.P$24
RESET  (via drill 0.46)
  Top 0.152: SV1.3 55.93,69.93 56.79,68.83 56.9,68.48 v56.9,61.47
  Top 0.254: U$3.P$38 89.4,40.4 89.53,40.26 89.53,36.79 C10.1 88.99,36.23 95.25,29.97 v96.52,29.97 | R11.2 R9.1 15.75,75.69 18.55,75.69 18.55,75.68 19.05,75.18 19.05,64.77 20.07,63.75 22.1,63.75 27.69,58.17 38.51,58.17 | 38.51,58.17 43.8,58.17 C4.1 56.46,61.04 v56.9,61.47 | U1.P$29 38.5,58.17 38.51,58.17 | U$2.10 93.6,21.08 96.77,21.08 v97.03,20.83
  Bottom 0.254: v56.9,61.47 57.15,61.72 90.42,61.72 99.82,52.32 99.82,46.99 100.08,46.74 100.08,29.97 | 100.08,29.97 v96.52,29.97 | 100.08,29.97 100.08,23.88 v97.03,20.83
RS-232_RX1  (via drill 0.46)
  Top 0.254: CONV.P$8 74.79,28.06 v74.42,27.69 | v35.29,10.4 J7.3
  Bottom 0.254: v35.29,10.4 35.56,10.67 55.63,10.67 72.64,27.69 v74.42,27.69
RS-232_TX1  (via drill 0.46)
  Top 0.254: J7.2 v33.29,10.43 | v68.83,25.4 68.89,25.46 CONV.P$13
  Bottom 0.254: v33.29,10.43 34.04,11.18 55.37,11.18 68.83,24.64 v68.83,25.4
RX1_3V3
  Top 0.254: U$3.P$17 78.8,35.11 71.74,28.06 CONV.P$9
SCK  (via drill 0.46)
  Top 0.152: SV1.2 53.42,69.55 53.42,67.69 52.53,66.8 50.29,66.8 v48.51,68.58
  Top 0.254: U1.P$17 34,67.53 v34.04,67.56
  Bottom 0.254: v34.04,67.56 36.83,67.56 37.85,68.58 v48.51,68.58
SCL_3V3  (via drill 0.46)
  Top 0.254: I2C_2.2 48.91,6.74 50.55,8.38 57.15,8.38 59.94,11.18 72.9,11.18 74.42,12.7 78.49,12.7 v78.74,12.95 78.74,13.46 77.47,14.73 R8.2 | v80.52,44.7 80.3,44.92 U$3.P$61 80.3,48.48 72.14,56.64 26.92,56.64 25.65,57.91 24.38,57.91 23.11,59.18 23.11,61.47 v22.35,62.23 21.73,62.85 I2C_1.2 | U1.P$28 37.7,60.81 v37.85,60.96
  Bottom 0.254: v80.52,44.7 79.76,43.94 79.76,13.97 v78.74,12.95 | v37.85,60.96 37.34,61.47 23.11,61.47 v22.35,62.23
SDA_3V3  (via drill 0.46)
  Top 0.254: v80.52,43.43 79.76,44.2 79.76,45.97 79.8,46.02 U$3.P$62 79.8,48.22 71.88,56.13 26.67,56.13 25.4,57.4 24.13,57.4 22.35,59.18 v22.35,60.96 21.71,61.6 I2C_1.3 | I2C_2.3 50.16,6.97 51.05,7.87 57.4,7.87 60.2,10.67 73.15,10.67 74.68,12.19 v79.5,12.19 79.5,13.72 78.99,14.22 R7.2 | 36.96,59.34 U1.P$27 36.9,60.64 v36.83,60.71
  Bottom 0.254: v80.52,43.43 80.26,43.18 80.26,12.95 v79.5,12.19 | v36.83,60.71 36.58,60.96 v22.35,60.96
T_BLUE_LED  (via drill 0.46)
  Top 0.254: Q2.1 89.09,11.24 v88.14,12.19 | U$3.P$30 85.3,34.59 v85.34,34.54
  Bottom 0.254: v85.34,34.54 84.07,34.54 81.79,32.26 81.79,13.97 82.3,13.46 86.87,13.46 v88.14,12.19
T_GREEN_LED  (via drill 0.46)
  Top 0.254: U$3.P$31 85.8,37.54 v85.85,37.59 | Q3.1 85.79,11.24 v84.84,12.19
  Bottom 0.254: v85.85,37.59 85.85,37.34 81.28,32.77 81.28,13.72 82.04,12.95 84.07,12.95 v84.84,12.19
T_OSC0
  Top 0.254: U$3.P$40 91.06,41.4 U$1.3 92.11,40.22 C18.1
T_OSC1
  Top 0.254: U$3.P$41 89.83,41.9 U$1.1 90.77,42.58 C17.1
T_RED_LED  (via drill 0.46)
  Top 0.254: U$3.P$29 84.8,37.56 v84.84,37.59 | Q4.1 82.48,11.24 v81.53,12.19
  Bottom 0.254: v84.84,37.59 80.77,33.53 80.77,12.95 v81.53,12.19
T_VDDC
  Top 0.254: U$3.P$25 82.8,33.47 C14.1 83.97,32.3 C1.1 | U$3.P$56 82.8,48.26 81.53,49.53 C13.1 81.51,52.09 83.46,52.88 C12.1
  Top 0.305: U$3.P$25 U$3.P$56
TX1_3V3
  Top 0.254: U$3.P$18 79.3,34.85 72.14,27.69 72.14,27.18 71.71,26.76 CONV.P$11
V_BATT  (via drill 0.46)
  Top 0.254: R1.2 102.87,9.16 v102.87,8.38
  other vias: 76.2,99.82 76.2,99.06 76.2,96.01 76.2,95.25 76.2,98.3 76.2,94.49 77.22,91.19 74.68,91.19 22.35,20.83 22.35,21.59 22.35,20.07 22.35,19.3 22.35,18.54 53.85,92.71 54.61,92.71 53.09,92.71 52.32,92.71 51.56,92.71 104.14,59.18 104.14,58.42 104.14,59.94 104.14,60.71 104.14,61.47 70.61,8.89 69.85,8.89 71.37,8.89 72.14,8.89 72.9,8.89 20.32,41.15 20.32,41.91 20.32,40.39 20.32,39.62 20.32,38.86 33.78,83.06 33.78,82.04 33.78,81.03 33.78,80.01 33.78,78.99 33.78,77.98 33.78,76.96 33.78,75.95 33.78,74.93 33.78,73.91 33.78,72.9 33.78,71.88
  pour Route15 (isolate 0.254, rank 6): -1.78,-1.78 -1.78,102.36 125.73,102.87 125.73,-1.27
  pour Top (rank 3, no thermals): 72.9,102.62 72.9,89.41 73.41,88.9 81.28,88.9 82.55,90.17 82.55,102.62
  pour Top (no thermals): 19.81,22.1 19.81,18.03 22.61,18.03 22.86,18.29 22.86,21.84 22.61,22.1
  pour Top (no thermals): 54.86,95.25 51.05,95.25 51.05,92.46 51.31,92.2 54.86,92.2 55.12,92.46 55.12,95
  pour Top (no thermals): 106.68,57.91 106.68,61.98 103.89,61.98 103.63,61.72 103.63,58.17 103.89,57.91
  pour Top (no thermals): 69.34,6.35 73.41,6.35 73.41,9.14 73.15,9.4 69.6,9.4 69.34,9.14
  pour Top (no thermals): 17.78,42.42 17.78,38.35 20.57,38.35 20.83,38.61 20.83,42.16 20.57,42.42
  pour Top: 33.27,83.57 33.27,71.37 40.13,71.37 41.66,72.9 41.66,82.04 40.13,83.57
  pour Route2: 33.27,83.57 33.27,71.37 40.13,71.37 41.66,72.9 41.66,82.04 40.13,83.57
  pour Bottom: 33.27,83.57 33.27,71.37 40.13,71.37 41.66,72.9 41.66,82.04 40.13,83.57

### Text on the board
tPlace: Kill Switch | RC Control
bPlace: July 2014 | Jonathan Kurzer | Jason Leung | Matthew Sauve | Andrew Wagenmaker | John Connolly | MAAV Spine Rev 14v1 | Ian Lin | University of Michigan | Michigan Autonomous Aerial Vehicles | Design By:
Reference: Forward | Power to Motor | Main Battery Connection | Kill Switch Reciever | Power to ATOM | Power to Motor | I2C Port for PX4 | Power to Motor | Selection switches for the Tiva | PPM port for DJI | Power to DJI | RC Control Reciever | I2C Port for PX4 | Serial to ATOM | power up switch | Power to Motor